# Altium project LoggerBoard.PrjPcb (part 1 of 2)
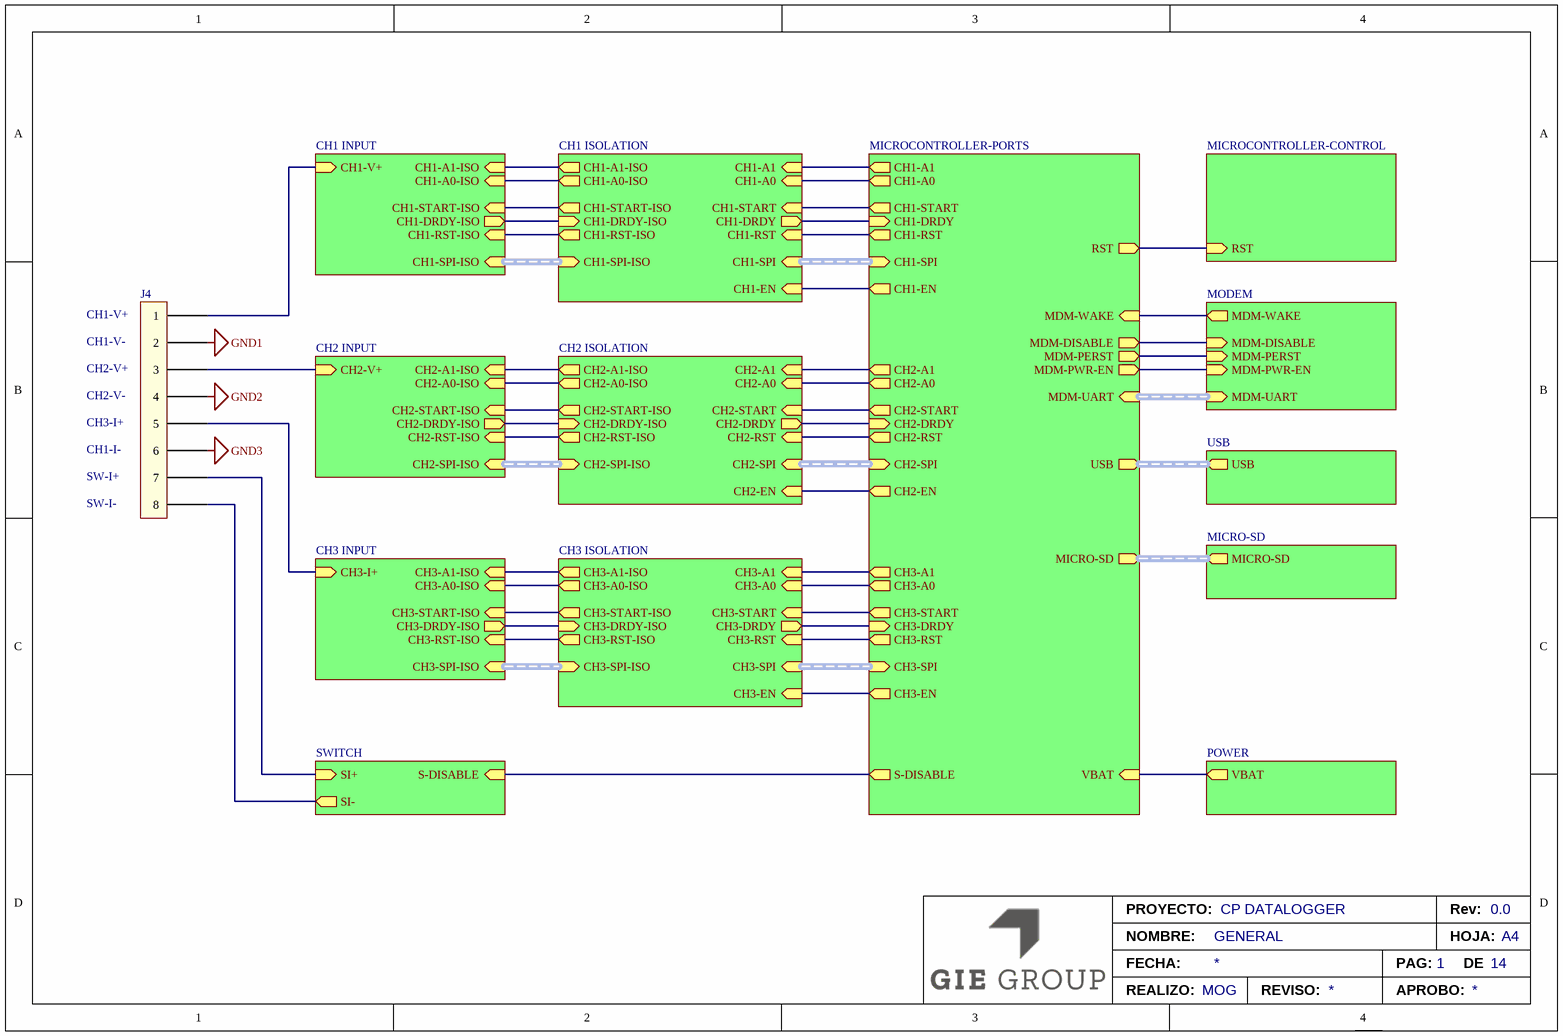
[diagram p0: General.SchDoc]
14 sheets, 197 parts. Net scope: hierarchical (ports join the sheet entries above them; power ports are global).
Board file: LoggerBoard.PcbDoc
Sheets:
  General.SchDoc
    CH1 INPUT = CH1-Input.SchDoc
    CH1 ISOLATION = CH1-Isolation.SchDoc
    CH2 INPUT = CH2-Input.SchDoc
    CH2 ISOLATION = CH2-Isolation.SchDoc
    MODEM = Modem.SchDoc
    CH3 INPUT = CH3-Input.SchDoc
    CH3 ISOLATION = CH3-Isolation.SchDoc
    SWITCH = Switch.SchDoc
    MICROCONTROLLER-PORTS = MicrocontrollerPorts.SchDoc
    POWER = Power.SchDoc
    MICROCONTROLLER-CONTROL = MicrocontrollerControl.SchDoc
    USB = Usb.SchDoc
    MICRO-SD = MicroSD.SchDoc

## Sheet General.SchDoc: GENERAL
size A4; Author: MOG; CompanyName: GIE GROUP; DrawnBy: MOG; Organization: Gie SA; Address1: Galicia 52; Address2: Mar del Plata; Address3: Buenos Aires; Address4: Argentina; DocumentNumber: 1; Revision: 0.0; SheetNumber: 1; SheetTotal: 14; Project: CP DATALOGGER; PageSetup: Record=PageOptions|CenterHorizontal=True|CenterVertical=True|PrintScale=0.94|XCorrection=1.00|YCorrection=1.00|PrintKind=0|BorderSize=5000000|LeftOffset=0|BottomOffset=0|Orientation=2|PaperLength=1000|PaperWidth=1000|Scale=100|PaperSource=7|PrintQuality=720|MediaType=1|DitherType=10|PaperKind=A4|PrintScaleMode=1

### Parts
J4  (no value)  [TE-640455-8]

### Sub-sheets
CH1 INPUT = CH1-Input.SchDoc: CH1-A0-ISO (in), CH1-A1-ISO (in), CH1-START-ISO (in), CH1-DRDY-ISO (out), CH1-RST-ISO (in), CH1-SPI-ISO (in, harness CH1-SPI-ISO), CH1-V+ (in)
CH1 ISOLATION = CH1-Isolation.SchDoc: CH1-A0-ISO (out), CH1-A1-ISO (out), CH1-START-ISO (out), CH1-DRDY-ISO (in), CH1-RST-ISO (out), CH1-SPI-ISO (in, harness CH1-SPI-ISO), CH1-A0 (in), CH1-A1 (in), CH1-START (in), CH1-DRDY (out), CH1-RST (in), CH1-SPI (in, harness CH1-SPI), CH1-EN (in)
CH2 INPUT = CH2-Input.SchDoc: CH2-A0-ISO (in), CH2-A1-ISO (in), CH2-START-ISO (in), CH2-DRDY-ISO (out), CH2-RST-ISO (in), CH2-SPI-ISO (in, harness CH2-SPI-ISO), CH2-V+ (in)
CH2 ISOLATION = CH2-Isolation.SchDoc: CH2-A0-ISO (out), CH2-A1-ISO (out), CH2-START-ISO (out), CH2-DRDY-ISO (in), CH2-RST-ISO (out), CH2-SPI-ISO (in, harness CH2-SPI-ISO), CH2-A0 (in), CH2-A1 (in), CH2-START (in), CH2-DRDY (out), CH2-RST (in), CH2-SPI (in, harness CH2-SPI), CH2-EN (in)
CH3 INPUT = CH3-Input.SchDoc: CH3-A0-ISO (in), CH3-A1-ISO (in), CH3-START-ISO (in), CH3-DRDY-ISO (out), CH3-RST-ISO (in), CH3-SPI-ISO (in, harness CH3-SPI-ISO), CH3-I+ (in)
CH3 ISOLATION = CH3-Isolation.SchDoc: CH3-A0-ISO (out), CH3-A1-ISO (out), CH3-START-ISO (out), CH3-DRDY-ISO (in), CH3-RST-ISO (out), CH3-SPI-ISO (in, harness CH3-SPI-ISO), CH3-A0 (in), CH3-A1 (in), CH3-START (in), CH3-DRDY (out), CH3-RST (in), CH3-SPI (in, harness CH3-SPI), CH3-EN (in)
MICRO-SD = MicroSD.SchDoc: MICRO-SD (out, harness MICRO-SD)
MICROCONTROLLER-CONTROL = MicrocontrollerControl.SchDoc: RST (in)
MICROCONTROLLER-PORTS = MicrocontrollerPorts.SchDoc: CH1-A0 (out), CH1-A1 (out), CH1-START (out), CH1-DRDY (in), CH1-RST (out), CH1-SPI (in, harness CH1-SPI), CH1-EN (out), CH2-A0 (out), CH2-A1 (out), CH2-START (out), CH2-DRDY (in), CH2-RST (out), CH2-SPI (in, harness CH2-SPI), CH2-EN (out), CH3-A0 (out), CH3-A1 (out), CH3-START (out), CH3-DRDY (in), CH3-RST (out), CH3-SPI (in, harness CH3-SPI), CH3-EN (out), S-DISABLE (out), MDM-UART (in, harness MDM-UART), MDM-WAKE (in), MDM-DISABLE (out), MDM-PERST (out), MDM-PWR-EN (out), VBAT (in), RST (out), USB (out, harness USB), MICRO-SD (out, harness MICRO-SD)
MODEM = Modem.SchDoc: MDM-UART (in, harness MDM-UART), MDM-WAKE (out), MDM-DISABLE (in), MDM-PERST (in), MDM-PWR-EN (in)
POWER = Power.SchDoc: VBAT (out)
SWITCH = Switch.SchDoc: S-DISABLE (in), SI+ (in), SI- (out)
USB = Usb.SchDoc: USB (out, harness USB)

### Nets
GND1: J4.2
GND2: J4.4
GND3: J4.6
CH1-A0: sheet CH1 ISOLATION/CH1-A0, sheet MICROCONTROLLER-PORTS/CH1-A0
CH1-A1: sheet CH1 ISOLATION/CH1-A1, sheet MICROCONTROLLER-PORTS/CH1-A1
CH1-DRDY: sheet CH1 ISOLATION/CH1-DRDY, sheet MICROCONTROLLER-PORTS/CH1-DRDY
CH1-EN: sheet CH1 ISOLATION/CH1-EN, sheet MICROCONTROLLER-PORTS/CH1-EN
CH1-RST: sheet CH1 ISOLATION/CH1-RST, sheet MICROCONTROLLER-PORTS/CH1-RST
CH1-START: sheet CH1 ISOLATION/CH1-START, sheet MICROCONTROLLER-PORTS/CH1-START
CH2-A0: sheet CH2 ISOLATION/CH2-A0, sheet MICROCONTROLLER-PORTS/CH2-A0
CH2-A1: sheet CH2 ISOLATION/CH2-A1, sheet MICROCONTROLLER-PORTS/CH2-A1
CH2-DRDY: sheet CH2 ISOLATION/CH2-DRDY, sheet MICROCONTROLLER-PORTS/CH2-DRDY
CH2-EN: sheet CH2 ISOLATION/CH2-EN, sheet MICROCONTROLLER-PORTS/CH2-EN
CH2-RST: sheet CH2 ISOLATION/CH2-RST, sheet MICROCONTROLLER-PORTS/CH2-RST
CH2-START: sheet CH2 ISOLATION/CH2-START, sheet MICROCONTROLLER-PORTS/CH2-START
CH3-A0: sheet CH3 ISOLATION/CH3-A0, sheet MICROCONTROLLER-PORTS/CH3-A0
CH3-A1: sheet CH3 ISOLATION/CH3-A1, sheet MICROCONTROLLER-PORTS/CH3-A1
CH3-DRDY: sheet CH3 ISOLATION/CH3-DRDY, sheet MICROCONTROLLER-PORTS/CH3-DRDY
CH3-EN: sheet CH3 ISOLATION/CH3-EN, sheet MICROCONTROLLER-PORTS/CH3-EN
CH3-RST: sheet CH3 ISOLATION/CH3-RST, sheet MICROCONTROLLER-PORTS/CH3-RST
CH3-START: sheet CH3 ISOLATION/CH3-START, sheet MICROCONTROLLER-PORTS/CH3-START
MDM-DISABLE: sheet MODEM/MDM-DISABLE, sheet MICROCONTROLLER-PORTS/MDM-DISABLE
MDM-PERST: sheet MODEM/MDM-PERST, sheet MICROCONTROLLER-PORTS/MDM-PERST
MDM-PWR-EN: sheet MODEM/MDM-PWR-EN, sheet MICROCONTROLLER-PORTS/MDM-PWR-EN
MDM-WAKE: sheet MODEM/MDM-WAKE, sheet MICROCONTROLLER-PORTS/MDM-WAKE
RST: sheet MICROCONTROLLER-PORTS/RST, sheet MICROCONTROLLER-CONTROL/RST
S-DISABLE: sheet SWITCH/S-DISABLE, sheet MICROCONTROLLER-PORTS/S-DISABLE
NetGDT1_1: J4.1 ; sheet CH1 INPUT/CH1-V+
NetGDT2_1: J4.3 ; sheet CH2 INPUT/CH2-V+
NetGDT3_1: J4.5 ; sheet CH3 INPUT/CH3-I+
NetJ4_7: J4.7 ; sheet SWITCH/SI+
NetJ4_8: J4.8 ; sheet SWITCH/SI-
NetJ10_2: sheet MICROCONTROLLER-PORTS/VBAT, sheet POWER/VBAT
NetU2_4: sheet CH1 INPUT/CH1-A0-ISO, sheet CH1 ISOLATION/CH1-A0-ISO
NetU2_5: sheet CH1 INPUT/CH1-A1-ISO, sheet CH1 ISOLATION/CH1-A1-ISO
NetU4_3: sheet CH1 INPUT/CH1-RST-ISO, sheet CH1 ISOLATION/CH1-RST-ISO
NetU4_4: sheet CH1 INPUT/CH1-START-ISO, sheet CH1 ISOLATION/CH1-START-ISO
NetU4_10: sheet CH1 INPUT/CH1-DRDY-ISO, sheet CH1 ISOLATION/CH1-DRDY-ISO
NetU10_4: sheet CH2 INPUT/CH2-A0-ISO, sheet CH2 ISOLATION/CH2-A0-ISO
NetU10_5: sheet CH2 INPUT/CH2-A1-ISO, sheet CH2 ISOLATION/CH2-A1-ISO
NetU12_3: sheet CH2 INPUT/CH2-RST-ISO, sheet CH2 ISOLATION/CH2-RST-ISO
NetU12_4: sheet CH2 INPUT/CH2-START-ISO, sheet CH2 ISOLATION/CH2-START-ISO
NetU12_10: sheet CH2 INPUT/CH2-DRDY-ISO, sheet CH2 ISOLATION/CH2-DRDY-ISO
NetU18_4: sheet CH3 INPUT/CH3-A0-ISO, sheet CH3 ISOLATION/CH3-A0-ISO
NetU18_5: sheet CH3 INPUT/CH3-A1-ISO, sheet CH3 ISOLATION/CH3-A1-ISO
NetU20_3: sheet CH3 INPUT/CH3-RST-ISO, sheet CH3 ISOLATION/CH3-RST-ISO
NetU20_4: sheet CH3 INPUT/CH3-START-ISO, sheet CH3 ISOLATION/CH3-START-ISO
NetU20_10: sheet CH3 INPUT/CH3-DRDY-ISO, sheet CH3 ISOLATION/CH3-DRDY-ISO

### Buses and harness runs
harness sheet CH1 INPUT/CH1-SPI-ISO = sheet CH1 ISOLATION/CH1-SPI-ISO
harness sheet CH1 ISOLATION/CH1-SPI = sheet MICROCONTROLLER-PORTS/CH1-SPI
harness sheet CH2 INPUT/CH2-SPI-ISO = sheet CH2 ISOLATION/CH2-SPI-ISO
harness sheet CH2 ISOLATION/CH2-SPI = sheet MICROCONTROLLER-PORTS/CH2-SPI
harness sheet CH3 INPUT/CH3-SPI-ISO = sheet CH3 ISOLATION/CH3-SPI-ISO
harness sheet CH3 ISOLATION/CH3-SPI = sheet MICROCONTROLLER-PORTS/CH3-SPI
harness sheet MICRO-SD/MICRO-SD = sheet MICROCONTROLLER-PORTS/MICRO-SD
harness sheet MICROCONTROLLER-PORTS/MDM-UART = sheet MODEM/MDM-UART
harness sheet MICROCONTROLLER-PORTS/USB = sheet USB/USB

### Notes on the sheet
- (near J4) CH1-V+
- (near J4) CH1-V-
- (near J4) CH2-V+
- (near J4) CH2-V-
- (near J4) CH3-I+
- (near J4) CH1-I-
- (near J4) SW-I+
- (near J4) SW-I-
- PROYECTO:
- Rev:
- NOMBRE:
- FECHA:
- REALIZO:
- REVISO:
- APROBO:
- PAG:
- HOJA:
- DE
- A4

### Library data of the parts
J4 = 640455-8: CONN HEADER RTANG 8POS .100 TIN; Mating Conn: 1375820-8

## Sheet CH1-Input.SchDoc: CH1 INPUT
size A4; Author: MOG; CompanyName: GIE GROUP; DrawnBy: MOG; Organization: Gie SA; Address1: Galicia 52; Address2: Mar del Plata; Address3: Buenos Aires; Address4: Argentina; DocumentNumber: 2; Revision: 0.0; SheetNumber: 2; SheetTotal: 14; Project: CP DATALOGGER; PageSetup: Record=PageOptions|CenterHorizontal=True|CenterVertical=True|PrintScale=0.94|XCorrection=1.00|YCorrection=1.00|PrintKind=0|BorderSize=5000000|LeftOffset=0|BottomOffset=0|Orientation=2|PaperLength=1000|PaperWidth=1000|Scale=100|PaperSource=7|PrintQuality=720|MediaType=1|DitherType=10|PaperKind=A4|PrintScaleMode=1
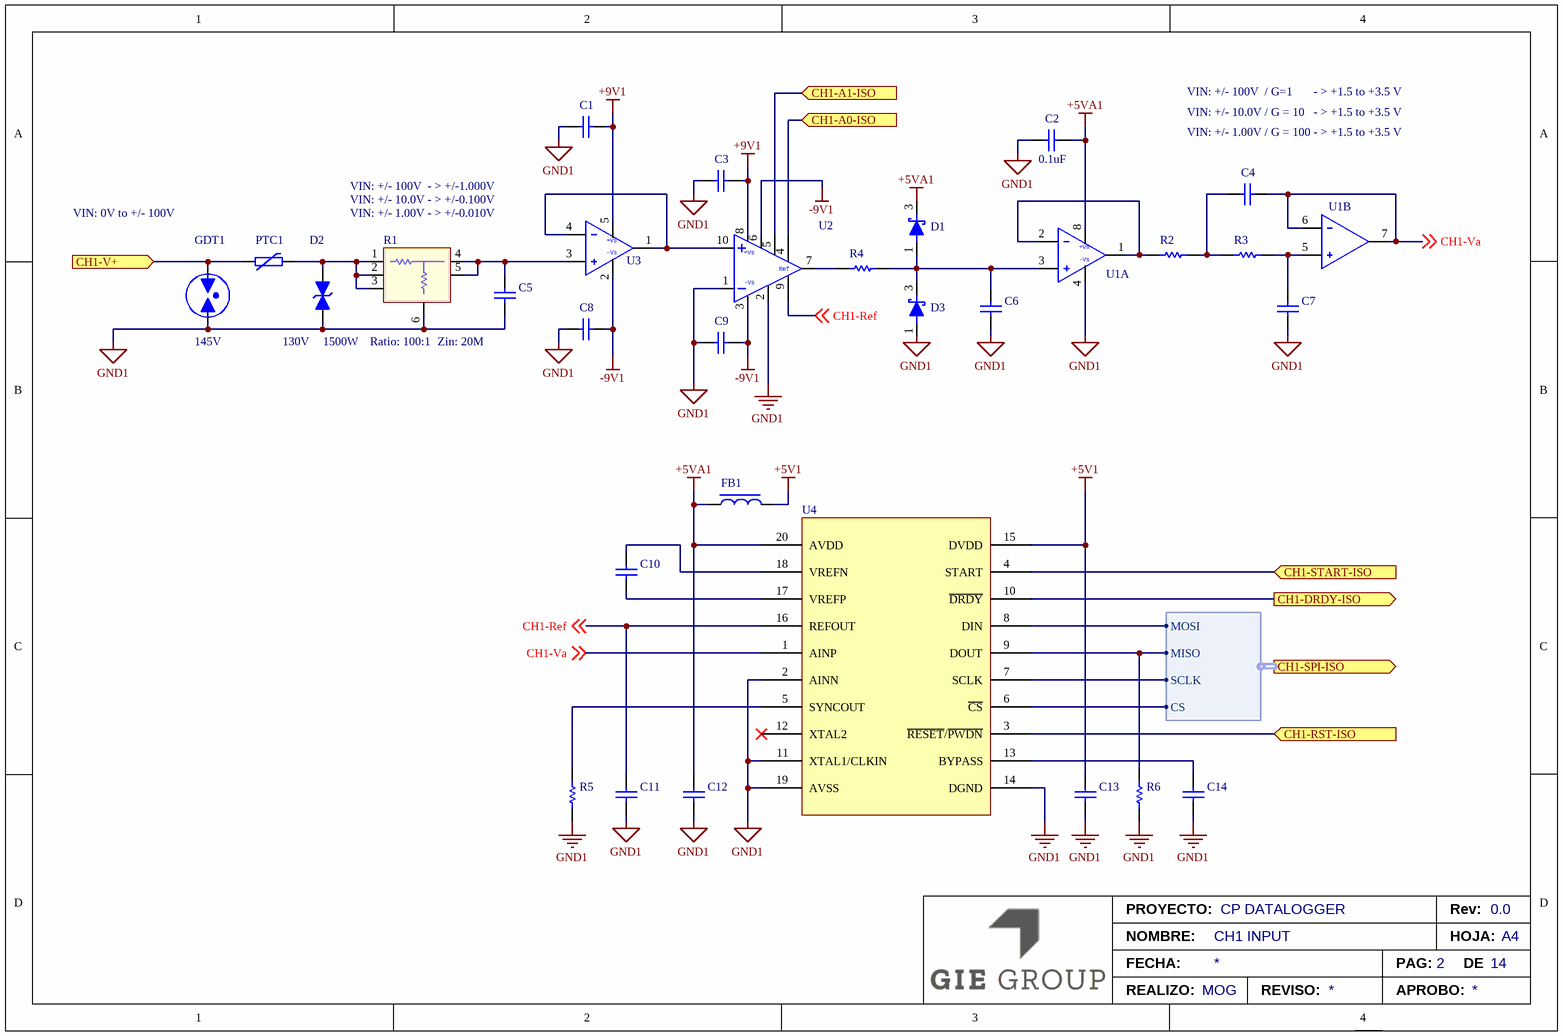
[diagram p1: CH1-Input.SchDoc]

### Parts
C1  C0603C104K5RACAUTO  [CAP-0603]  (value not drawn)
C2  value 0.1uF  [CAP-0603]  (hidden comment: C0603C104K5RACAUTO)
C3  C0603C104K5RACAUTO  [CAP-0603]  (value not drawn)
C4  C0603C162J5GAC7867  [CAP-0603]  (value not drawn)
C5  C0603C161J1GAC7867  [CAP-0603]  (value not drawn)
C6  C0603C162J5GAC7867  [CAP-0603]  (value not drawn)
C7  C0603C161J1GAC7867  [CAP-0603]  (value not drawn)
C8  C0603C104K5RACAUTO  [CAP-0603]  (value not drawn)
C9  C0603C104K5RACAUTO  [CAP-0603]  (value not drawn)
C10  C0603C105M3RAC7867  [CAP-0603]  (value not drawn)
C11  C0603C105M3RAC7867  [CAP-0603]  (value not drawn)
C12  C0603C105M3RAC7867  [CAP-0603]  (value not drawn)
C13  C0603C105M3RAC7867  [CAP-0603]  (value not drawn)
C14  C0603C105M3RAC7867  [CAP-0603]  (value not drawn)
D1  NSVBAT54WT1G  [SOT-323-3]  (value not drawn)
D2  Voltage: 130V  Power: 1500W  [SMC - BIIDIR]
D3  (no value)  [SOT-323-3]
FB1  Z0603C121GPWZT  [IND-0603]  (value not drawn)
GDT1  Voltage: 145V  [LITTLELFUSE-CG5XXXLTR]
PTC1  (no value)  [LITTLELFUSE-72R020X]
R1  Ratio: 100:1  Zin: 20M  [CADDOCK - HVD5-B20M-050-05]
R2  RC0603FR-07113KL  [RES-0603]  (value not drawn)
R3  RC0603FR-07887KL  [RES-0603]  (value not drawn)
R4  RC0603FR-07100KL  [RES-0603]  (value not drawn)
R5  RC0603FR-071ML  [RES-0603]  (value not drawn)
R6  RC0603FR-071ML  [RES-0603]  (value not drawn)
U1  (no value)  [MSOP8]  (parts A,B of 2)
U2  AD8253ARMZ  [MSOP10]  (value not drawn)
U3  (no value)  [SOT23-5]
U4  (no value)  [TSSOP20]

### Ports
CH1-A0-ISO (in), CH1-A1-ISO (in), CH1-DRDY-ISO (out), CH1-RST-ISO (in), CH1-SPI-ISO (out, harness CH1-SPI-ISO), CH1-START-ISO (in), CH1-V+ (in)

### Harnesses
CH1-SPI-ISO: MOSI, MISO, SCLK, CS

### Nets
+5V1: C13.2 FB1.2 U4.15(DVDD)
+5VA1: C2.2 C12.2 D1.3(K) FB1.1 U1.8(+VS) U4.20(AVDD)
+9V1: C1.2 C3.2 U2.8(+Vs) U3.5(+VS)
-9V1: C8.2 C9.2 U2.3(-Vs) U2.6(WR) U3.2(-Vs)
GND1: C1.1 C2.1 C3.1 C5.1 C6.1 C7.1 C8.1 C9.1 C11.1 C12.1 C13.1 C14.1 D2.2(K) D3.1(A) GDT1.2(K) R1.6 R5.1 R6.1 U1.4(-Vs) U2.1(-_IN) U2.2(DGND) U4.2(AINN) U4.11(XTAL1/CLKIN) U4.14(DGND) U4.19(AVSS)
CH1-Ref: C11.2 U2.9(REF) U4.16(REFOUT) ; off-sheet CH1-Ref
CH1-Va: C4.1 U1.6(-INB) U1.7(OUTB) U4.1(AINP) ; off-sheet CH1-Va
NetC4_2: C4.2 R2.2 R3.1
NetC5_2: C5.2 R1.4 R1.5 U3.3(+IN)
NetC6_2: C6.2 D1.1(A) D3.3(K) R4.2 U1.3(+INA)
NetC7_2: C7.2 R3.2 U1.5(+INB)
NetC10_1: C10.1 U4.17(VREFP)
NetC10_2: C10.2 U4.18(VREFN)
NetC14_2: C14.2 U4.13(BYPASS)
NetD2_1: D2.1(A) PTC1.2 R1.1 R1.2 R1.3
NetGDT1_1: GDT1.1(A) PTC1.1 ; port CH1-V+
NetR2_1: R2.1 U1.1(OUTA) U1.2(-INA)
NetR4_1: R4.1 U2.7(OUT)
NetR5_2: R5.2 U4.5(SYNCOUT)
NetR6_2: R6.2 U4.9(DOUT) ; port CH1-SPI-ISO.MISO
NetU2_4: U2.4(A0) ; port CH1-A0-ISO
NetU2_5: U2.5(A1) ; port CH1-A1-ISO
NetU2_10: U2.10(+_IN) U3.1(OUT) U3.4(-IN)
NetU4_3: U4.3(~{RESET}/~{PWDN}) ; port CH1-RST-ISO
NetU4_4: U4.4(START) ; port CH1-START-ISO
NetU4_6: U4.6(~{CS}) ; port CH1-SPI-ISO.CS
NetU4_7: U4.7(SCLK) ; port CH1-SPI-ISO.SCLK
NetU4_8: U4.8(DIN) ; port CH1-SPI-ISO.MOSI
NetU4_10: U4.10(~{DRDY}) ; port CH1-DRDY-ISO

Not connected (* = marked no-connect by the designer): U4 12(XTAL2)*

### Notes on the sheet
- VIN: +/- 100V  / G=1       - > +1.5 to +3.5 V
- VIN: +/- 10.0V / G = 10   - > +1.5 to +3.5 V
- VIN: +/- 1.00V / G = 100 - > +1.5 to +3.5 V
- VIN: 0V to +/- 100V
- VIN: +/- 100V  - > +/-1.000V
- VIN: +/- 10.0V - > +/-0.100V
- (near R1) VIN: +/- 1.00V - > +/-0.010V
- PROYECTO:
- Rev:
- NOMBRE:
- FECHA:
- REALIZO:
- REVISO:
- APROBO:
- PAG:
- HOJA:
- DE
- A4
- (in symbol AD8253ARMZ) Ref
- (in symbol AD8638ARJZ) +Vs
- (in symbol ADA4051-2ARMZ, part A) +Vs

### Library data of the parts
C1-C3 C8 C9 = C0603C104K5RACAUTO: CAP CER 0.1uF 50V X7R 0603; Manufacturer: Kemet; Tolerance: 10%; Voltage: 50; PartNumber: C0603C104K5RACAUTO; Supplier 1: Digi-Key; Supplier 2: Mouser; Supplier Part Number 1: 399-6856-1-ND; Supplier Part Number 2: 80-C0603C104K5RAUTO
C4 C6 = C0603C162J5GAC7867: CAP CER 1600´pF 50V C0G 0603; Manufacturer: Kemet; Tolerance: 5%; Voltage: 50; PartNumber: C0603C162J5GAC7867; Supplier 1: Digi-Key; Supplier 2: Mouser; Supplier Part Number 1: 399-15368-1-ND; Supplier Part Number 2: 80-C0603C162J5G
C5 = C0603C751J5GAC7867: CAP CER 750´pF 50V C0G 0603; Manufacturer: Kemet; Tolerance: 5%; PartNumber: C0603C161J1GAC7867; Voltage: 50V; Supplier 1: Digi-Key; Supplier 2: Mouser; Supplier Part Number 1: 399-C0603C751J5GAC7867CT-ND; Supplier Part Number 2: 80-C0603C751J5G
C7 = C0603C161J1GAC7867: CAP CER 160 pF 100V C0G 0603; Manufacturer: Kemet; Tolerance: 5%; PartNumber: C0603C161J1GAC7867; Voltage: 100V; Supplier 1: Digi-Key; Supplier Part Number 1: 399-15367-1-ND
C10-C14 = C0603C105M3RAC7867: CAP CER 1uF 25V X7R 0603; Manufacturer: Kemet; Tolerance: 20%; Voltage: 25; PartNumber: C0603C105M3RAC7867; Supplier 1: Digi-Key; Supplier 2: Mouser; Supplier Part Number 1: 399-C0603C105M3RAC7867CT-ND; Supplier Part Number 2: 80-C0603C105M3R
D1 D3 = NSVBAT54WT1G: Schottky Diode 30V 200mA SOT323; Manufacturer: OnSemiconductor; IF(avg): 0.2A; VR(rms): 30V; Supplier 1: Digi-Key; Supplier 2: Mouser; Supplier Part Number 1: NSVBAT54WT1GOSDKR-ND; Supplier Part Number 2: 863-NSVBAT54WT1G
  D1: PartNumber: NSVBAT54WT1G
D2 = 1.5SMC130CA: TVS Diode 1.5kW 130V 5% Bi-Directional; Manufacturer: Littelfuse; Supplier 1: Digi-Key; Supplier 2: Mouser; Supplier Part Number 1: 1.5SMC130CACT-ND; Supplier Part Number 2: 576-1.5SMC130CA
FB1 = Z0603C121GPWZT: Ferrite Bead 120Ohms 900mA 25% DCR=130m; Manufacturer: Kemet; PartNumber: Z0603C121GPWZT; Supplier 1: Digi-Key; Supplier 2: Mouser; Supplier Part Number 1: 399-Z0603C121GPWZTCT-ND; Supplier Part Number 2: 80-Z0603C121GPWZT
GDT1 = CG5145LTR: Gas Discharge Tube 145V; Manufacturer: Littelfuse; Supplier 1: Digi-Key; Supplier 2: Mouser; Supplier Part Number 1: CG5145LTR-ND; Supplier Part Number 2: 576-CG5145LTR
PTC1 = 72R020XPR: PTC Polyfuse Radial 72V 0.2A; Manufacturer: Littlelfuse; Ihold: 0.2A; Supplier 1: Digi-Key; Supplier 2: Mouser; Supplier Part Number 1: 72R020XPRCT-ND; Supplier Part Number 2: 576-72R020XPR
R1 = HVD5-B20M-050-05: 20M ohm 0.05% 5ppm Voltage Divider; Manufacturer: Caddock; Supplier 1: Digi-Key; Supplier 2: Mouser; Supplier Part Number 1: HVD5-B20M-050-05-ND; Supplier Part Number 2: 684-HVD5-B20M
R2 = RC0603FR-07113KL: RES SMD 113K OHM 1% 1/10W 0603; Manufacturer: Yageo; Power: 0.1W; Tolerance: 1%; PartNumber: RC0603FR-07113KL; Supplier 1: Digi-Key; Supplier 2: Mouser; Supplier Part Number 2: 603-RC0603FR-07113KL; Supplier Part Number 1: 311-113KHRCT-ND
R3 = RC0603FR-07887KL: RES SMD 887K OHM 1% 1/10W 0603; Manufacturer: Yageo; Power: 0.1W; Tolerance: 1%; PartNumber: RC0603FR-07887KL; Supplier 1: Digi-Key; Supplier 2: Mouser; Supplier Part Number 1: 311-887KHRCT-ND; Supplier Part Number 2: 603-RC0603FR-07887KL
R4 = RC0603FR-07100KL: RES SMD 100K OHM 1% 1/10W 0603; Manufacturer: Yageo; Power: 0.1W; Tolerance: 1%; PartNumber: RC0603FR-07100KL; Supplier 1: Digi-Key; Supplier 2: Mouser; Supplier Part Number 1: 311-100KHRCT-ND; Supplier Part Number 2: 603-RC0603FR-07100KL
R5 R6 = RC0603FR-071ML: RES SMD 1M OHM 1% 1/10W 0603; Manufacturer: Yageo; Power: 0.1W; Tolerance: 1%; PartNumber: RC0603FR-071ML; Supplier 1: Digi-Key; Supplier 2: Mouser; Supplier Part Number 1: 311-887KHRCT-ND; Supplier Part Number 2: 603-RC0603FR-07887KL
U1 = ADA4051-2ARMZ: Dual  Precision Amplifier Micro Power Auto Zero; Manufacturer: Analog Devices; Supplier 1: Digi-Key; Supplier 2: Mouser; Supplier Part Number 1: 505-ADA4051-2ARMZ-ND; Supplier Part Number 2: 584-ADA4051-2ARMZ
U2 = AD8253ARMZ: Instrumentation Amplifiers High Speed Programmable High Gain In-Amp; Manufacturer: Analog Devices Inc; PartNumber: AD8253ARMZ; Supplier 1: Digi-Key; Supplier 2: Mouser; Supplier Part Number 1: 505-AD8253ARMZ-R7DKR-ND; Supplier Part Number 2: 584-AD8253ARMZ-R7
U3 = AD8638ARJZ: 16V Auto-Zero CMOS Amplifier; Manufacturer: Analog Devices; Supplier 1: Digi-Key; Supplier 2: Mouser; Supplier Part Number 1: 505-AD8638ARJZ-REEL7DKR-ND; Supplier Part Number 2: 584-AD8638ARJZ-R7
U4 = ADS1259BIPW: Analog to Digital Converter 14.4kSPS 24-Bit; Manufacturer: Texas Instruments; Supplier 1: Digi-Key; Supplier 2: Mouser; Supplier Part Number 1: 296-27183-5-ND; Supplier Part Number 2: 595-ADS1259BIPW

## Sheet CH1-Isolation.SchDoc: CH1 ISOLATION
size A4; Author: MOG; CompanyName: GIE GROUP; DrawnBy: MOG; Organization: Gie SA; Address1: Galicia 52; Address2: Mar del Plata; Address3: Buenos Aires; Address4: Argentina; DocumentNumber: 3; Revision: 0.0; SheetNumber: 3; SheetTotal: 14; Project: CP DATALOGGER; PageSetup: Record=PageOptions|CenterHorizontal=True|CenterVertical=True|PrintScale=0.94|XCorrection=1.00|YCorrection=1.00|PrintKind=0|BorderSize=5000000|LeftOffset=0|BottomOffset=0|Orientation=2|PaperLength=1000|PaperWidth=1000|Scale=100|PaperSource=7|PrintQuality=720|MediaType=1|DitherType=10|PaperKind=A4|PrintScaleMode=1
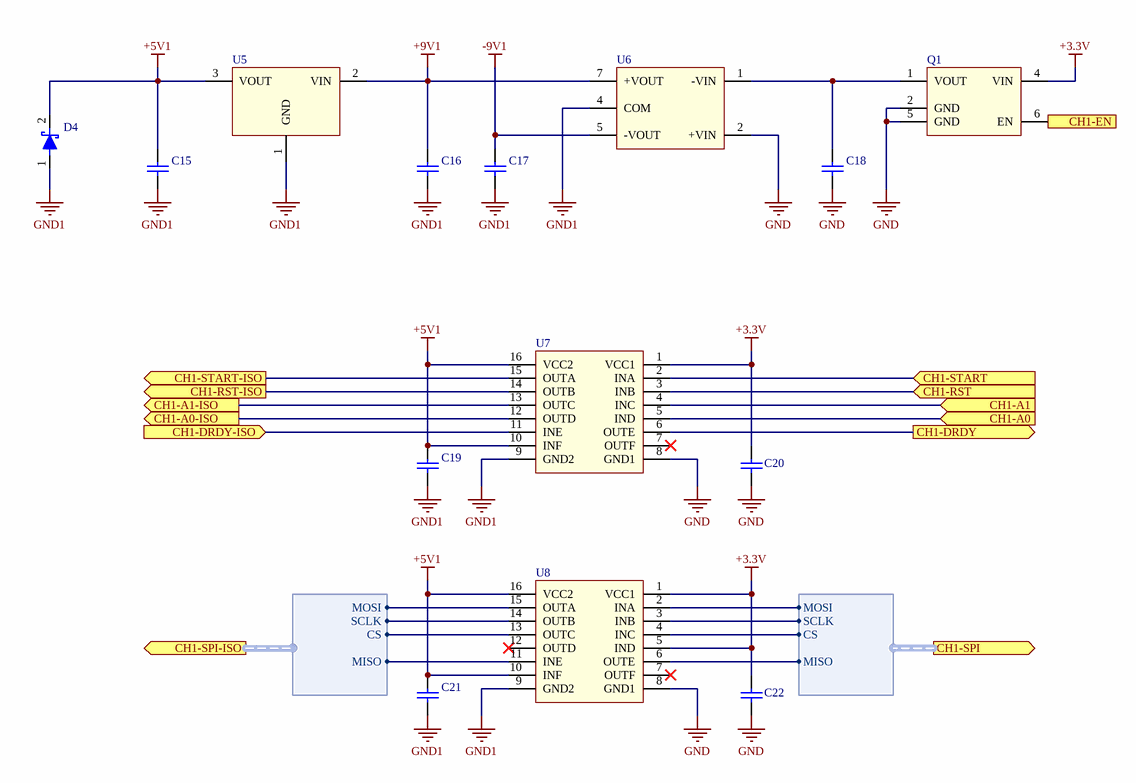
[diagram p2: CH1-Isolation.SchDoc]

### Parts
C15  C0603C105M3RAC7867  [CAP-0603]  (value not drawn)
C16  C0603C105M3RAC7867  [CAP-0603]  (value not drawn)
C17  C0603C105M3RAC7867  [CAP-0603]  (value not drawn)
C18  C0603C105M3RAC7867  [CAP-0603]  (value not drawn)
C19  C0603C105M3RAC7867  [CAP-0603]  (value not drawn)
C20  C0603C105M3RAC7867  [CAP-0603]  (value not drawn)
C21  C0603C105M3RAC7867  [CAP-0603]  (value not drawn)
C22  C0603C105M3RAC7867  [CAP-0603]  (value not drawn)
D4  (no value)  [SOD323 - DIODE UNIDIR]
Q1  (no value)  [TSSOP6]
U5  (no value)  [SOT23-5]
U6  R1D-3.309/P  [RECOM-R1D]  (value not drawn)
U7  (no value)  [SSOP16]
U8  (no value)  [SSOP16]

### Ports
CH1-A0 (in), CH1-A0-ISO (out), CH1-A1 (in), CH1-A1-ISO (out), CH1-DRDY (out), CH1-DRDY-ISO (in), CH1-EN (in), CH1-RST (in), CH1-RST-ISO (out), CH1-SPI (out, harness CH1-SPI), CH1-SPI-ISO (out, harness CH1-SPI-ISO), CH1-START (in), CH1-START-ISO (out)

### Harnesses
CH1-SPI-ISO: MOSI, MISO, SCLK, CS
CH1-SPI: MOSI, MISO, SCLK, CS

### Nets
+3.3V: C20.2 C22.2 Q1.4(VIN) U7.1(VCC1) U8.1(VCC1) U8.5(IND)
+5V1: C15.2 C19.2 C21.2 D4.2(K) U5.3(VOUT) U7.10(INF) U7.16(VCC2) U8.10(INF) U8.16(VCC2)
+9V1: C16.2 U5.2(VIN) U6.7(+VOUT)
-9V1: C17.2 U6.5(-VOUT)
GND: C18.1 C20.1 C22.1 Q1.2(GND) Q1.5(GND) U6.2(+VIN) U7.8(GND1) U8.8(GND1)
GND1: C15.1 C16.1 C17.1 C19.1 C21.1 D4.1(A) U5.1(GND) U6.4(COM) U7.9(GND2) U8.9(GND2)
CH1-A0: U7.5(IND) ; port CH1-A0
CH1-A1: U7.4(INC) ; port CH1-A1
CH1-DRDY: U7.6(OUTE) ; port CH1-DRDY
CH1-EN: Q1.6(EN) ; port CH1-EN
CH1-RST: U7.3(INB) ; port CH1-RST
CH1-SPI.CS: U8.4(INC) ; port CH1-SPI.CS
CH1-SPI.MISO: U8.6(OUTE) ; port CH1-SPI.MISO
CH1-SPI.MOSI: U8.2(INA) ; port CH1-SPI.MOSI
CH1-SPI.SCLK: U8.3(INB) ; port CH1-SPI.SCLK
CH1-START: U7.2(INA) ; port CH1-START
NetC18_2: C18.2 Q1.1(VOUT) U6.1(-VIN)
NetR6_2: U8.11(INE) ; port CH1-SPI-ISO.MISO
NetU2_4: U7.12(OUTD) ; port CH1-A0-ISO
NetU2_5: U7.13(OUTC) ; port CH1-A1-ISO
NetU4_3: U7.14(OUTB) ; port CH1-RST-ISO
NetU4_4: U7.15(OUTA) ; port CH1-START-ISO
NetU4_6: U8.13(OUTC) ; port CH1-SPI-ISO.CS
NetU4_7: U8.14(OUTB) ; port CH1-SPI-ISO.SCLK
NetU4_8: U8.15(OUTA) ; port CH1-SPI-ISO.MOSI
NetU4_10: U7.11(INE) ; port CH1-DRDY-ISO

Not connected (* = marked no-connect by the designer): U7 7(OUTF)*; U8 7(OUTF)* 12(OUTD)*

### Notes on the sheet
- PROYECTO:
- Rev:
- NOMBRE:
- FECHA:
- REALIZO:
- REVISO:
- APROBO:
- PAG:
- HOJA:
- DE
- A4

### Library data of the parts
C15-C22 = C0603C105M3RAC7867: as C10 on sheet CH1-Input; PartNumber: C0603C105M3RAC7867; Supplier 1: Digi-Key; Supplier 2: Mouser; Supplier Part Number 1: 399-C0603C105M3RAC7867CT-ND; Supplier Part Number 2: 80-C0603C105M3R
D4 = MM3Z5V6T1G: Schottky Diode 30V 200mA SOT323; Manufacturer: OnSemiconductor
Q1 = MIC94092YC6-TR: Manufacturer: Microchip
U5 = NCP716BCSN500T1G: IC REG LDO 0.5V 0.15A TSOT23-5; Manufacturer: ON Semiconductor
U6 = R1D-3.309/P: DC DC CONVERTER +/-9V 1W; Manufacturer: Recom; Supplier 1: Digi-Key; Supplier 2: Mouser; Supplier Part Number 1: R1D-3.309/P-ND; Supplier Part Number 2: 919-R1D-3.309P
U7 U8 = ISO7762FDBQ: Digital Isolator, six-channel, 4/2, 16-SSOP; Manufacturer: Texas Instruments; Supplier 1: Digi-Key; Supplier 2: Mouser; Supplier Part Number 1: 296-49452-6-ND; Supplier Part Number 2: 595-ISO7762FDBQR

## Sheet CH2-Input.SchDoc: CH2 INPUT
size A4; Author: MOG; CompanyName: GIE GROUP; DrawnBy: MOG; Organization: Gie SA; Address1: Galicia 52; Address2: Mar del Plata; Address3: Buenos Aires; Address4: Argentina; DocumentNumber: 4; Revision: 0.0; SheetNumber: 5; SheetTotal: 14; Project: CP DATALOGGER; PageSetup: Record=PageOptions|CenterHorizontal=True|CenterVertical=True|PrintScale=0.94|XCorrection=1.00|YCorrection=1.00|PrintKind=0|BorderSize=5000000|LeftOffset=0|BottomOffset=0|Orientation=2|PaperLength=1000|PaperWidth=1000|Scale=100|PaperSource=7|PrintQuality=720|MediaType=1|DitherType=10|PaperKind=A4|PrintScaleMode=1
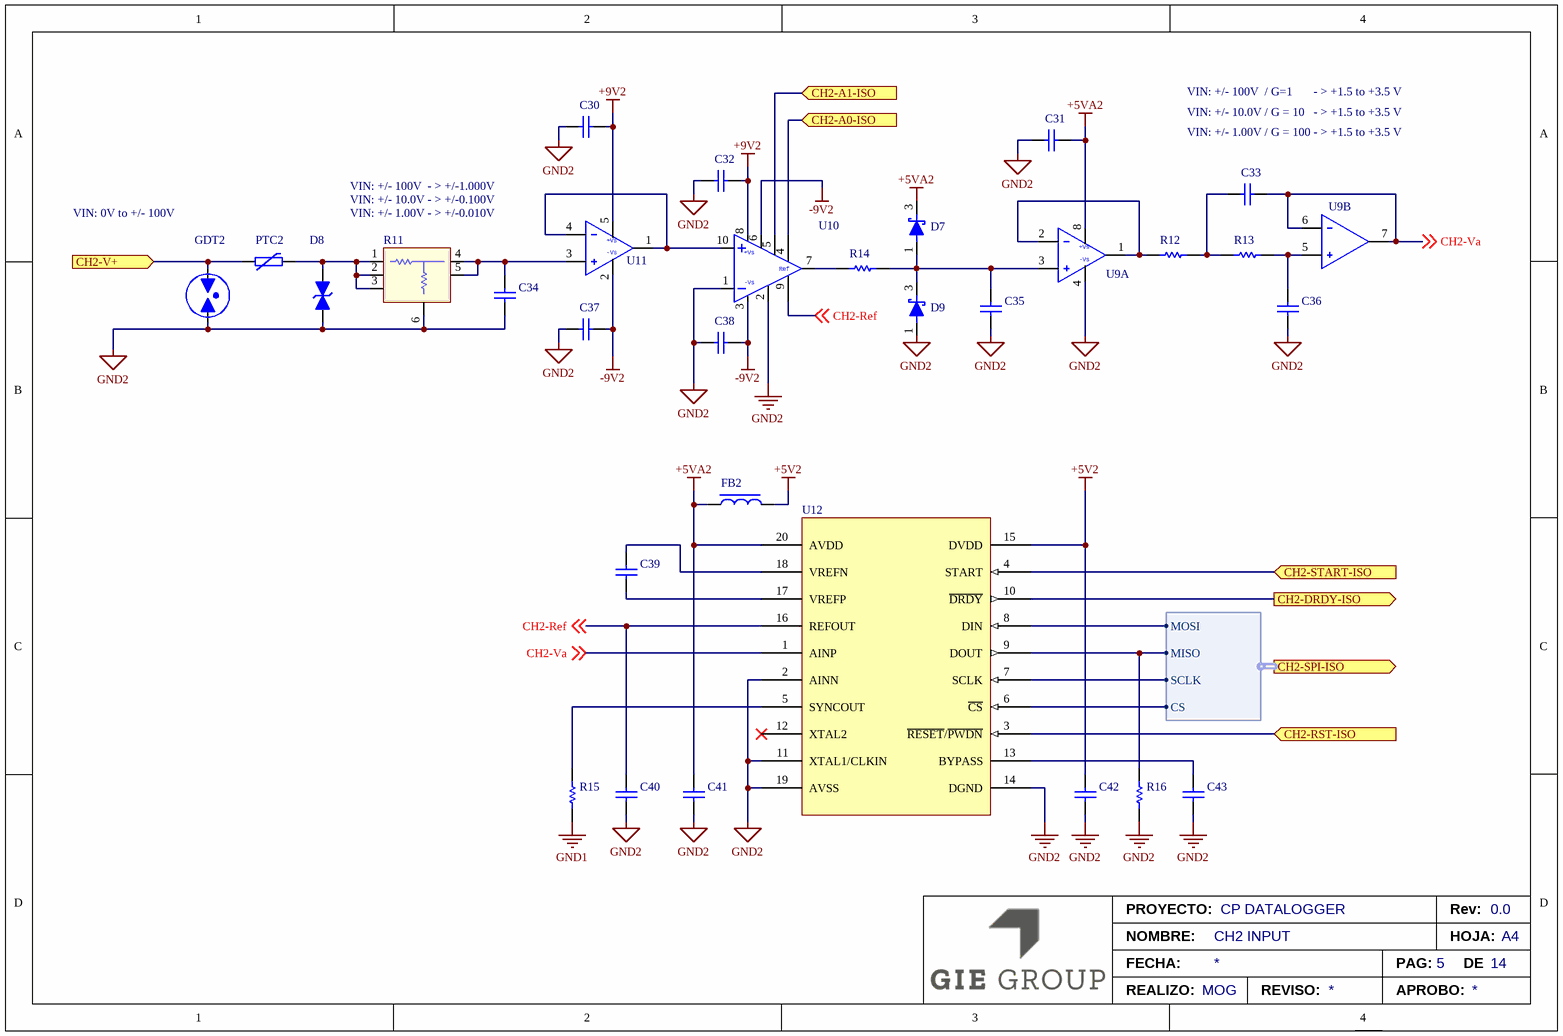
[diagram p3: CH2-Input.SchDoc]

### Parts
C30  C0603C104K5RACAUTO  [CAP-0603]  (value not drawn)
C31  C0603C104K5RACAUTO  [CAP-0603]  (value not drawn)
C32  C0603C104K5RACAUTO  [CAP-0603]  (value not drawn)
C33  C0603C162J5GAC7867  [CAP-0603]  (value not drawn)
C34  C0603C161J1GAC7867  [CAP-0603]  (value not drawn)
C35  C0603C162J5GAC7867  [CAP-0603]  (value not drawn)
C36  C0603C161J1GAC7867  [CAP-0603]  (value not drawn)
C37  C0603C104K5RACAUTO  [CAP-0603]  (value not drawn)
C38  C0603C104K5RACAUTO  [CAP-0603]  (value not drawn)
C39  C0603C105M3RAC7867  [CAP-0603]  (value not drawn)
C40  C0603C105M3RAC7867  [CAP-0603]  (value not drawn)
C41  C0603C105M3RAC7867  [CAP-0603]  (value not drawn)
C42  C0603C105M3RAC7867  [CAP-0603]  (value not drawn)
C43  C0603C105M3RAC7867  [CAP-0603]  (value not drawn)
D7  NSVBAT54WT1G  [SOT-323-3]  (value not drawn)
D8  (no value)  [SMC - BIIDIR]
D9  (no value)  [SOT-323-3]
FB2  Z0603C121GPWZT  [IND-0603]  (value not drawn)
GDT2  (no value)  [LITTLELFUSE-CG5XXXLTR]
PTC2  (no value)  [LITTLELFUSE-72R020X]
R11  (no value)  [CADDOCK - HVD5-B20M-050-05]
R12  RC0603FR-07113KL  [RES-0603]  (value not drawn)
R13  RC0603FR-07887KL  [RES-0603]  (value not drawn)
R14  RC0603FR-07100KL  [RES-0603]  (value not drawn)
R15  RC0603FR-071ML  [RES-0603]  (value not drawn)
R16  RC0603FR-071ML  [RES-0603]  (value not drawn)
U9  (no value)  [MSOP8]  (parts A,B of 2)
U10  AD8253ARMZ  [MSOP10]  (value not drawn)
U11  (no value)  [SOT23-5]
U12  (no value)  [TSSOP20]

### Ports
CH2-A0-ISO (in), CH2-A1-ISO (in), CH2-DRDY-ISO (out), CH2-RST-ISO (in), CH2-SPI-ISO (out, harness CH2-SPI-ISO), CH2-START-ISO (in), CH2-V+ (in)

### Harnesses
CH2-SPI-ISO: MOSI, MISO, SCLK, CS

### Nets
+5V2: C42.2 FB2.2 U12.15(DVDD)
+5VA2: C31.2 C41.2 D7.3(K) FB2.1 U9.8(+VS) U12.20(AVDD)
+9V2: C30.2 C32.2 U10.8(+Vs) U11.5(+VS)
-9V2: C37.2 C38.2 U10.3(-Vs) U10.6(WR) U11.2(-Vs)
GND1: R15.1
GND2: C30.1 C31.1 C32.1 C34.1 C35.1 C36.1 C37.1 C38.1 C40.1 C41.1 C42.1 C43.1 D8.2(K) D9.1(A) GDT2.2(K) R11.6 R16.1 U9.4(-Vs) U10.1(-_IN) U10.2(DGND) U12.2(AINN) U12.11(XTAL1/CLKIN) U12.14(DGND) U12.19(AVSS)
CH2-Ref: C40.2 U10.9(REF) U12.16(REFOUT) ; off-sheet CH2-Ref
CH2-Va: C33.1 U9.6(-INB) U9.7(OUTB) U12.1(AINP) ; off-sheet CH2-Va
NetC33_2: C33.2 R12.2 R13.1
NetC34_2: C34.2 R11.4 R11.5 U11.3(+IN)
NetC35_2: C35.2 D7.1(A) D9.3(K) R14.2 U9.3(+INA)
NetC36_2: C36.2 R13.2 U9.5(+INB)
NetC39_1: C39.1 U12.17(VREFP)
NetC39_2: C39.2 U12.18(VREFN)
NetC43_2: C43.2 U12.13(BYPASS)
NetD8_1: D8.1(A) PTC2.2 R11.1 R11.2 R11.3
NetGDT2_1: GDT2.1(A) PTC2.1 ; port CH2-V+
NetR12_1: R12.1 U9.1(OUTA) U9.2(-INA)
NetR14_1: R14.1 U10.7(OUT)
NetR15_2: R15.2 U12.5(SYNCOUT)
NetR16_2: R16.2 U12.9(DOUT) ; port CH2-SPI-ISO.MISO
NetU10_4: U10.4(A0) ; port CH2-A0-ISO
NetU10_5: U10.5(A1) ; port CH2-A1-ISO
NetU10_10: U10.10(+_IN) U11.1(OUT) U11.4(-IN)
NetU12_3: U12.3(~{RESET}/~{PWDN}) ; port CH2-RST-ISO
NetU12_4: U12.4(START) ; port CH2-START-ISO
NetU12_6: U12.6(~{CS}) ; port CH2-SPI-ISO.CS
NetU12_7: U12.7(SCLK) ; port CH2-SPI-ISO.SCLK
NetU12_8: U12.8(DIN) ; port CH2-SPI-ISO.MOSI
NetU12_10: U12.10(~{DRDY}) ; port CH2-DRDY-ISO

Not connected (* = marked no-connect by the designer): U12 12(XTAL2)*

### Notes on the sheet
- VIN: +/- 100V  / G=1       - > +1.5 to +3.5 V
- VIN: +/- 10.0V / G = 10   - > +1.5 to +3.5 V
- VIN: +/- 1.00V / G = 100 - > +1.5 to +3.5 V
- VIN: 0V to +/- 100V
- VIN: +/- 100V  - > +/-1.000V
- VIN: +/- 10.0V - > +/-0.100V
- (near R11) VIN: +/- 1.00V - > +/-0.010V
- PROYECTO:
- Rev:
- NOMBRE:
- FECHA:
- REALIZO:
- REVISO:
- APROBO:
- PAG:
- HOJA:
- DE
- A4
- (in symbol AD8253ARMZ) Ref
- (in symbol AD8638ARJZ) +Vs
- (in symbol ADA4051-2ARMZ, part A) +Vs

### Library data of the parts
C30-C32 C37 C38 = C0603C104K5RACAUTO: as C1 on sheet CH1-Input; PartNumber: C0603C104K5RACAUTO; Supplier 1: Digi-Key; Supplier 2: Mouser; Supplier Part Number 1: 399-6856-1-ND; Supplier Part Number 2: 80-C0603C104K5RAUTO
C33 C35 = C0603C162J5GAC7867: as C4 on sheet CH1-Input; PartNumber: C0603C162J5GAC7867; Supplier 1: Digi-Key; Supplier 2: Mouser; Supplier Part Number 1: 399-15368-1-ND; Supplier Part Number 2: 80-C0603C162J5G
C34 = C0603C751J5GAC7867: as C5 on sheet CH1-Input; PartNumber: C0603C161J1GAC7867; Voltage: 50V; Supplier 1: Digi-Key; Supplier 2: Mouser; Supplier Part Number 1: 399-C0603C751J5GAC7867CT-ND; Supplier Part Number 2: 80-C0603C751J5G
C36 = C0603C161J1GAC7867: as C7 on sheet CH1-Input; PartNumber: C0603C161J1GAC7867; Voltage: 100V; Supplier 1: Digi-Key; Supplier Part Number 1: 399-15367-1-ND
C39-C43 = C0603C105M3RAC7867: as C10 on sheet CH1-Input; PartNumber: C0603C105M3RAC7867; Supplier 1: Digi-Key; Supplier 2: Mouser; Supplier Part Number 1: 399-C0603C105M3RAC7867CT-ND; Supplier Part Number 2: 80-C0603C105M3R
D7 D9 = NSVBAT54WT1G: as D1 on sheet CH1-Input; VR(rms): 30V; Supplier 1: Digi-Key; Supplier 2: Mouser; Supplier Part Number 1: NSVBAT54WT1GOSDKR-ND; Supplier Part Number 2: 863-NSVBAT54WT1G
  D7: PartNumber: NSVBAT54WT1G
D8 = 1.5SMC130CA: as D2 on sheet CH1-Input; Supplier 1: Digi-Key; Supplier 2: Mouser; Supplier Part Number 1: 1.5SMC130CACT-ND; Supplier Part Number 2: 576-1.5SMC130CA
FB2 = Z0603C121GPWZT: as FB1 on sheet CH1-Input; PartNumber: Z0603C121GPWZT; Supplier 1: Digi-Key; Supplier 2: Mouser; Supplier Part Number 1: 399-Z0603C121GPWZTCT-ND; Supplier Part Number 2: 80-Z0603C121GPWZT
GDT2 = CG5145LTR: as GDT1 on sheet CH1-Input; Supplier 1: Digi-Key; Supplier 2: Mouser; Supplier Part Number 1: CG5145LTR-ND; Supplier Part Number 2: 576-CG5145LTR
PTC2 = 72R020XPR: as PTC1 on sheet CH1-Input; Ihold: 0.2A; Supplier 1: Digi-Key; Supplier 2: Mouser; Supplier Part Number 1: 72R020XPRCT-ND; Supplier Part Number 2: 576-72R020XPR
R11 = HVD5-B20M-050-05: as R1 on sheet CH1-Input; Supplier 1: Digi-Key; Supplier 2: Mouser; Supplier Part Number 1: HVD5-B20M-050-05-ND; Supplier Part Number 2: 684-HVD5-B20M
R12 = RC0603FR-07113KL: as R2 on sheet CH1-Input; Tolerance: 1%; PartNumber: RC0603FR-07113KL; Supplier 1: Digi-Key; Supplier 2: Mouser; Supplier Part Number 2: 603-RC0603FR-07113KL; Supplier Part Number 1: 311-113KHRCT-ND
R13 = RC0603FR-07887KL: as R3 on sheet CH1-Input; Tolerance: 1%; PartNumber: RC0603FR-07887KL; Supplier 1: Digi-Key; Supplier 2: Mouser; Supplier Part Number 1: 311-887KHRCT-ND; Supplier Part Number 2: 603-RC0603FR-07887KL
R14 = RC0603FR-07100KL: as R4 on sheet CH1-Input; Tolerance: 1%; PartNumber: RC0603FR-07100KL; Supplier 1: Digi-Key; Supplier 2: Mouser; Supplier Part Number 1: 311-100KHRCT-ND; Supplier Part Number 2: 603-RC0603FR-07100KL
R15 R16 = RC0603FR-071ML: as R5 on sheet CH1-Input; Tolerance: 1%; PartNumber: RC0603FR-071ML; Supplier 1: Digi-Key; Supplier 2: Mouser; Supplier Part Number 1: 311-887KHRCT-ND; Supplier Part Number 2: 603-RC0603FR-07887KL
U9 = ADA4051-2ARMZ: as U1 on sheet CH1-Input; Supplier 1: Digi-Key; Supplier 2: Mouser; Supplier Part Number 1: 505-ADA4051-2ARMZ-ND; Supplier Part Number 2: 584-ADA4051-2ARMZ
U10 = AD8253ARMZ: as U2 on sheet CH1-Input; PartNumber: AD8253ARMZ; Supplier 1: Digi-Key; Supplier 2: Mouser; Supplier Part Number 1: 505-AD8253ARMZ-R7DKR-ND; Supplier Part Number 2: 584-AD8253ARMZ-R7
U11 = AD8638ARJZ: as U3 on sheet CH1-Input; Supplier 1: Digi-Key; Supplier 2: Mouser; Supplier Part Number 1: 505-AD8638ARJZ-REEL7DKR-ND; Supplier Part Number 2: 584-AD8638ARJZ-R7
U12 = ADS1259BIPW: as U4 on sheet CH1-Input; Supplier 1: Digi-Key; Supplier 2: Mouser; Supplier Part Number 1: 296-27183-5-ND; Supplier Part Number 2: 595-ADS1259BIPW

## Sheet CH2-Isolation.SchDoc: CH2 ISOLATION
size A4; Author: MOG; CompanyName: GIE GROUP; DrawnBy: MOG; Organization: Gie SA; Address1: Galicia 52; Address2: Mar del Plata; Address3: Buenos Aires; Address4: Argentina; DocumentNumber: 5; Revision: 0.0; SheetNumber: 6; SheetTotal: 14; Project: CP DATALOGGER; PageSetup: Record=PageOptions|CenterHorizontal=True|CenterVertical=True|PrintScale=0.94|XCorrection=1.00|YCorrection=1.00|PrintKind=0|BorderSize=5000000|LeftOffset=0|BottomOffset=0|Orientation=2|PaperLength=1000|PaperWidth=1000|Scale=100|PaperSource=7|PrintQuality=720|MediaType=1|DitherType=10|PaperKind=A4|PrintScaleMode=1
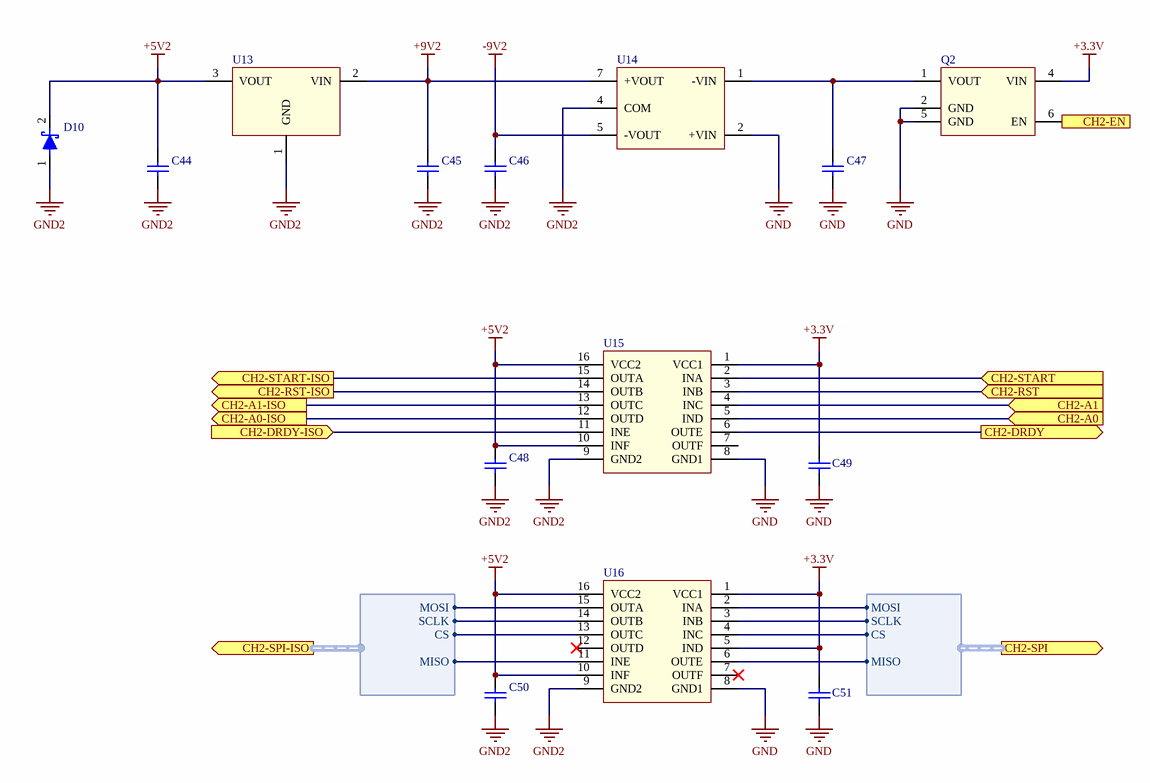
[diagram p4: CH2-Isolation.SchDoc]

### Parts
C44  C0603C105M3RAC7867  [CAP-0603]  (value not drawn)
C45  C0603C105M3RAC7867  [CAP-0603]  (value not drawn)
C46  C0603C105M3RAC7867  [CAP-0603]  (value not drawn)
C47  C0603C105M3RAC7867  [CAP-0603]  (value not drawn)
C48  C0603C105M3RAC7867  [CAP-0603]  (value not drawn)
C49  C0603C105M3RAC7867  [CAP-0603]  (value not drawn)
C50  C0603C105M3RAC7867  [CAP-0603]  (value not drawn)
C51  C0603C105M3RAC7867  [CAP-0603]  (value not drawn)
D10  (no value)  [SOD323 - DIODE UNIDIR]
Q2  (no value)  [TSSOP6]
U13  (no value)  [SOT23-5]
U14  R1D-3.309/P  [RECOM-R1D]  (value not drawn)
U15  (no value)  [SSOP16]
U16  (no value)  [SSOP16]

### Ports
CH2-A0 (in), CH2-A0-ISO (out), CH2-A1 (in), CH2-A1-ISO (out), CH2-DRDY (out), CH2-DRDY-ISO (in), CH2-EN (in), CH2-RST (in), CH2-RST-ISO (out), CH2-SPI (out, harness CH2-SPI), CH2-SPI-ISO (out, harness CH2-SPI-ISO), CH2-START (in), CH2-START-ISO (out)

### Harnesses
CH2-SPI-ISO: MOSI, MISO, SCLK, CS
CH2-SPI: MOSI, MISO, SCLK, CS

### Nets
+3.3V: C49.2 C51.2 Q2.4(VIN) U15.1(VCC1) U16.1(VCC1) U16.5(IND)
+5V2: C44.2 C48.2 C50.2 D10.2(K) U13.3(VOUT) U15.10(INF) U15.16(VCC2) U16.10(INF) U16.16(VCC2)
+9V2: C45.2 U13.2(VIN) U14.7(+VOUT)
-9V2: C46.2 U14.5(-VOUT)
GND: C47.1 C49.1 C51.1 Q2.2(GND) Q2.5(GND) U14.2(+VIN) U15.8(GND1) U16.8(GND1)
GND2: C44.1 C45.1 C46.1 C48.1 C50.1 D10.1(A) U13.1(GND) U14.4(COM) U15.9(GND2) U16.9(GND2)
CH2-A0: U15.5(IND) ; port CH2-A0
CH2-A1: U15.4(INC) ; port CH2-A1
CH2-DRDY: U15.6(OUTE) ; port CH2-DRDY
CH2-EN: Q2.6(EN) ; port CH2-EN
CH2-RST: U15.3(INB) ; port CH2-RST
CH2-SPI.CS: U16.4(INC) ; port CH2-SPI.CS
CH2-SPI.MISO: U16.6(OUTE) ; port CH2-SPI.MISO
CH2-SPI.MOSI: U16.2(INA) ; port CH2-SPI.MOSI
CH2-SPI.SCLK: U16.3(INB) ; port CH2-SPI.SCLK
CH2-START: U15.2(INA) ; port CH2-START
NetC47_2: C47.2 Q2.1(VOUT) U14.1(-VIN)
NetR16_2: U16.11(INE) ; port CH2-SPI-ISO.MISO
NetU10_4: U15.12(OUTD) ; port CH2-A0-ISO
NetU10_5: U15.13(OUTC) ; port CH2-A1-ISO
NetU12_3: U15.14(OUTB) ; port CH2-RST-ISO
NetU12_4: U15.15(OUTA) ; port CH2-START-ISO
NetU12_6: U16.13(OUTC) ; port CH2-SPI-ISO.CS
NetU12_7: U16.14(OUTB) ; port CH2-SPI-ISO.SCLK
NetU12_8: U16.15(OUTA) ; port CH2-SPI-ISO.MOSI
NetU12_10: U15.11(INE) ; port CH2-DRDY-ISO

Not connected (* = marked no-connect by the designer): U15 7(OUTF); U16 7(OUTF)* 12(OUTD)*

### Notes on the sheet
- PROYECTO:
- Rev:
- NOMBRE:
- FECHA:
- REALIZO:
- REVISO:
- APROBO:
- PAG:
- HOJA:
- DE
- A4

### Library data of the parts
C44-C51 = C0603C105M3RAC7867: as C10 on sheet CH1-Input; PartNumber: C0603C105M3RAC7867; Supplier 1: Digi-Key; Supplier 2: Mouser; Supplier Part Number 1: 399-C0603C105M3RAC7867CT-ND; Supplier Part Number 2: 80-C0603C105M3R
D10 = MM3Z5V6T1G: as D4 on sheet CH1-Isolation
Q2 = MIC94092YC6-TR: Manufacturer: Microchip
U13 = NCP716BCSN500T1G: as U5 on sheet CH1-Isolation
U14 = R1D-3.309/P: as U6 on sheet CH1-Isolation; Supplier 1: Digi-Key; Supplier 2: Mouser; Supplier Part Number 1: R1D-3.309/P-ND; Supplier Part Number 2: 919-R1D-3.309P
U15 U16 = ISO7762FDBQ: as U7 on sheet CH1-Isolation; Supplier 1: Digi-Key; Supplier 2: Mouser; Supplier Part Number 1: 296-49452-6-ND; Supplier Part Number 2: 595-ISO7762FDBQR

## Sheet Modem.SchDoc: MODEM
size A4; Author: MOG; CompanyName: GIE GROUP; DrawnBy: MOG; Organization: Gie SA; Address1: Galicia 52; Address2: Mar del Plata; Address3: Buenos Aires; Address4: Argentina; DocumentNumber: 9; Revision: 0.0; SheetNumber: 4; SheetTotal: 14; Project: CP DATALOGGER; PageSetup: Record=PageOptions|CenterHorizontal=True|CenterVertical=True|PrintScale=0.94|XCorrection=1.00|YCorrection=1.00|PrintKind=0|BorderSize=5000000|LeftOffset=0|BottomOffset=0|Orientation=2|PaperLength=1000|PaperWidth=1000|Scale=100|PaperSource=7|PrintQuality=720|MediaType=1|DitherType=10|PaperKind=A4|PrintScaleMode=1
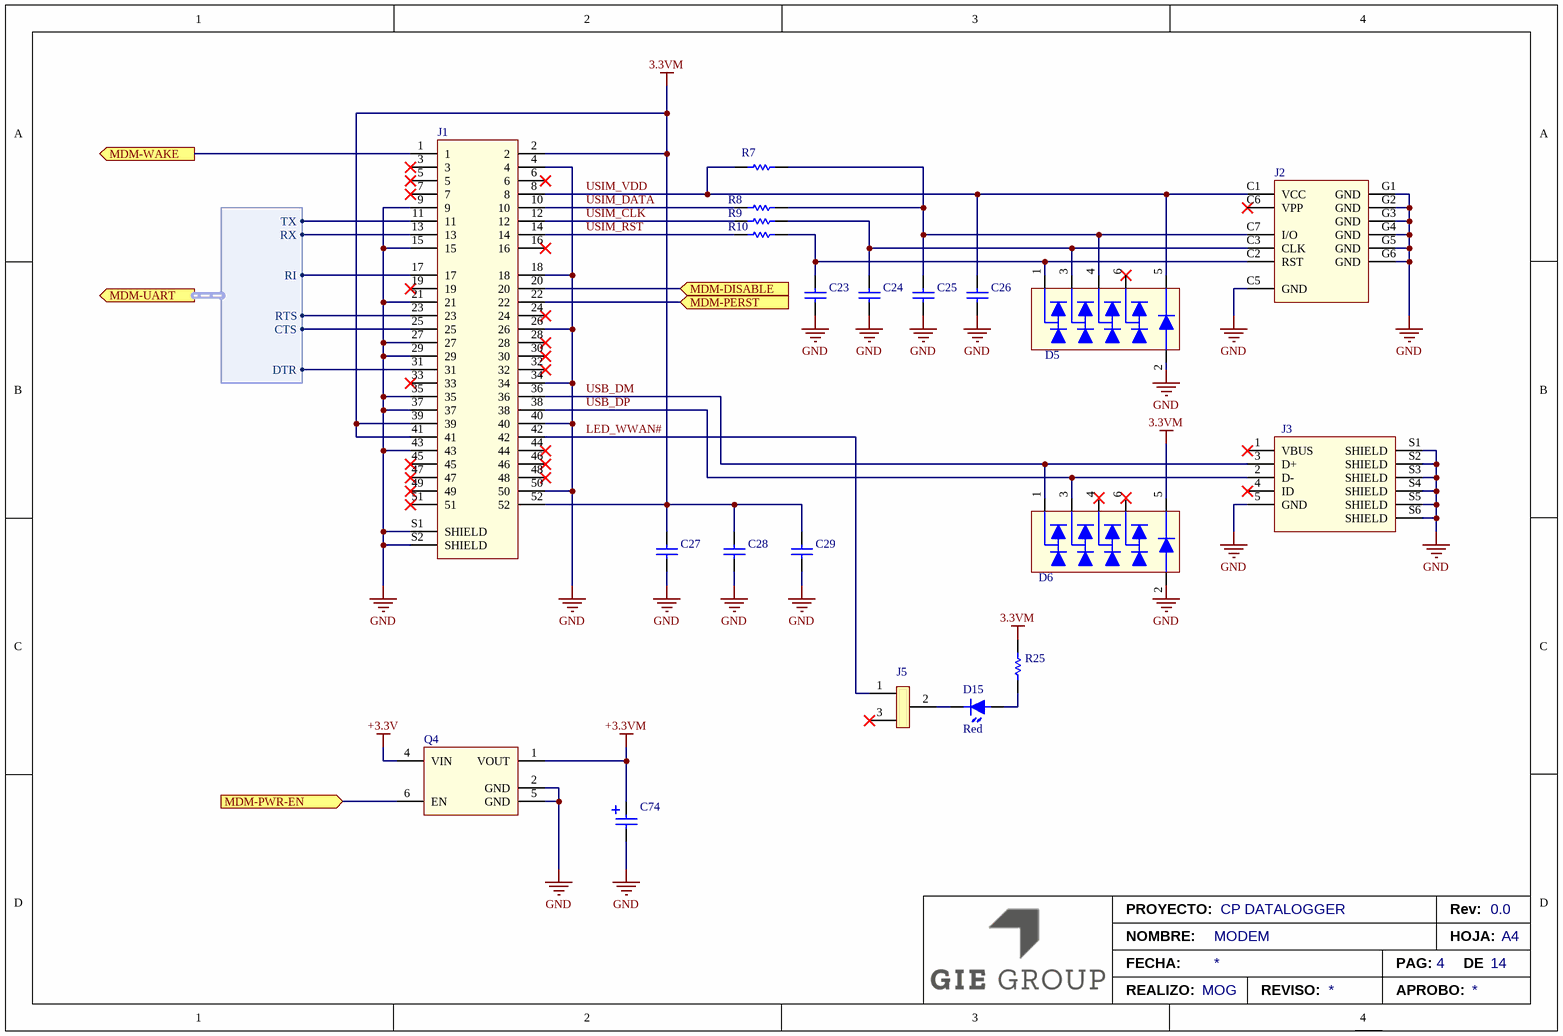
[diagram p5: Modem.SchDoc]

### Parts
C23  C0603C330F3GAC7867  [CAP-0603]  (value not drawn)
C24  C0603C330F3GAC7867  [CAP-0603]  (value not drawn)
C25  C0603C330F3GAC7867  [CAP-0603]  (value not drawn)
C26  C0603C330F3GAC7867  [CAP-0603]  (value not drawn)
C27  C0603C104K5RACAUTO  [CAP-0603]  (value not drawn)
C28  C0603C330F3GAC7867  [CAP-0603]  (value not drawn)
C29  C0603C100K3GAC7867  [CAP-0603]  (value not drawn)
C74  EEE-FK0J471P  [CAP_ALUM_SIZE_F]  (value not drawn)
D5  (no value)  [TSSOP6]
D6  (no value)  [TSSOP6]
D15  Color: Red  [0805 - LED]  (hidden comment: LTST-C170KRKT)
J1  0679100002  [MOLEX-679100002]  (value not drawn)
J2  (no value)  [MOLEX-786463001]
J3  473460001  [MOLEX-473460001]  (value not drawn)
J5  PRPC003SAAN-RC  [PIN3]  (value not drawn)
Q4  (no value)  [TSSOP6]
R7  RC0603FR-0715KL  [RES-0603]  (value not drawn)
R8  RC0603FR-0722RL  [RES-0603]  (value not drawn)
R9  RC0603FR-0722RL  [RES-0603]  (value not drawn)
R10  RC0603FR-0722RL  [RES-0603]  (value not drawn)
R25  RC0805FR-07100KL  [RES-0603]  (value not drawn)

### Ports
MDM-DISABLE (in), MDM-PERST (in), MDM-PWR-EN (in), MDM-UART (out, harness MDM-UART), MDM-WAKE (out)

### Harnesses
MDM-UART: RX, TX, RI, CTS, RTS, DTR

### Nets
3.3VM: C27.2 C28.2 C29.2 D6.5 J1.2 J1.39 J1.41 J1.52 R25.2
+3.3V: Q4.4(VIN)
+3.3VM: C74.1 Q4.1(VOUT)
GND: C23.1 C24.1 C25.1 C26.1 C27.1 C28.1 C29.1 C74.2 D5.2 D6.2 J1.4 J1.9 J1.15 J1.18 J1.21 J1.26 J1.27 J1.29 J1.34 J1.35 J1.37 J1.40 J1.43 J1.50 J1.S1(SHIELD) J1.S2(SHIELD) J2.C5(GND) J2.G1(GND) J2.G2(GND) J2.G3(GND) J2.G4(GND) J2.G5(GND) J2.G6(GND) J3.5(GND) J3.S1(SHIELD) J3.S2(SHIELD) J3.S3(SHIELD) J3.S4(SHIELD) J3.S5(SHIELD) J3.S6(SHIELD) Q4.2(GND) Q4.5(GND)
LED_WWAN#: J1.42 J5.1
MDM-DISABLE: J1.20 ; port MDM-DISABLE
MDM-PERST: J1.22 ; port MDM-PERST
MDM-PWR-EN: Q4.6(EN) ; port MDM-PWR-EN
MDM-UART.CTS: J1.25 ; port MDM-UART.CTS
MDM-UART.DTR: J1.31 ; port MDM-UART.DTR
MDM-UART.RI: J1.17 ; port MDM-UART.RI
MDM-UART.RTS: J1.23 ; port MDM-UART.RTS
MDM-UART.RX: J1.13 ; port MDM-UART.RX
MDM-UART.TX: J1.11 ; port MDM-UART.TX
MDM-WAKE: J1.1 ; port MDM-WAKE
USB_DM: D6.1 J1.36 J3.3(D+)
USB_DP: D6.3 J1.38 J3.2(D-)
USIM_CLK: J1.12 R9.1
USIM_DATA: J1.10 R8.1
USIM_RST: J1.14 R10.1
USIM_VDD: C26.2 D5.5 J1.8 J2.C1(VCC) R7.1
NetC23_2: C23.2 D5.1 J2.C2(RST) R10.2
NetC24_2: C24.2 D5.3 J2.C3(CLK) R9.2
NetC25_2: C25.2 D5.4 J2.C7(I/O) R7.2 R8.2
NetD15_1: D15.1(A) R25.1
NetD15_2: D15.2(K) J5.2

Not connected (* = marked no-connect by the designer): D5 6*; D6 4* 6*; J1 3* 5* 6* 7* 16* 19* 24* 28* 30* 32* 33* 44* 45* 46* 47* 48* 49* 51*; J2 C6(VPP)*; J3 1(VBUS)* 4(ID)*; J5 3*

### Notes on the sheet
- PROYECTO:
- Rev:
- NOMBRE:
- FECHA:
- REALIZO:
- REVISO:
- APROBO:
- PAG:
- HOJA:
- DE
- A4

### Library data of the parts
C23-C26 C28 = C0603C330F3GAC7867: CAP CER 33 pF 25V C0G 0603; Manufacturer: Kemet; Tolerance: 1%; PartNumber: C0603C330F3GAC7867; Voltage: 25V
C27 = C0603C104K5RACAUTO: as C1 on sheet CH1-Input; PartNumber: C0603C104K5RACAUTO; Supplier 1: Digi-Key; Supplier 2: Mouser; Supplier Part Number 1: 399-6856-1-ND; Supplier Part Number 2: 80-C0603C104K5RAUTO
C29 = C0603C100K3GAC7867: CAP CER 10 pF 25V C0G 0603; Manufacturer: Kemet; Tolerance: 10%; PartNumber: C0603C100K3GAC7867; Voltage: 25V
C74 = EEE-FK0J471P: CAP ALUM 470UF 20% 6.3V SMD; Manufacturer: Panasonic; Part}Number: EEE-FK0J471P
D5 D6 = CM1213A-04SO: TVS DIODE 3.3VWM 10VC 4CH SC74; Manufacturer: OnSemiconductor
D15 = LTST-C170KRKT: LED RED CLEAR 0805 SMD; Manufacturer: Lite-On Inc; Supplier 1: Digi-Key; Supplier Part Number 1: 160-1415-6-ND; Supplier 2: Mouser; Supplier Part Number 2: 859-LTST-C170KRKT; PartNumber: LTST-C170KRKT
J1 = Molex 0679100002: Connector Mini PCI Express 52POS - Quectel modem; Manufacturer: Molex; PartNumber: 0679100002; Supplier 1: Digi-Key; Supplier Part Number 1: WM3470CT-ND; Supplier 2: Mouser; Supplier Part Number 2: 538-67910-0002
J2 = 786463001: 6 Position Card Connector Micro SIM Surface Mount, Right Angle Gold; Supplier 1: Digi-Key; Supplier 2: Mouser; Supplier Part Number 1: WM9364CT-ND; Supplier Part Number 2: 538-78646-3001
J3 = 473460001: USB Connectors MICRO USB B RECPT BTTM MOUNT ASSY; Manufacturer: Molex; PartNumber: 473460001
J5 = PRPC003SAAN-RC: CONN HEADER .100" SNGL STR 3POS; Manufacturer: Sullins Connector Solutions; PartNumber: PRPC003SAAN-RC; Supplier 1: Digi-Key; Supplier Part Number 1: S1011EC-03-ND
Q4 = MIC94092YC6-TR: Manufacturer: Microchip
R7 = RC0603FR-0715KL: RES SMD 15.0K OHM 1% 1/10W 0603; Manufacturer: Yageo; Power: 0.1W; Tolerance: 1%; PartNumber: RC0603FR-0715KL
R8-R10 = RC0603FR-0722RL: RES SMD 22 OHM 1% 1/10W 0603; Manufacturer: Yageo; Power: 0.1W; Tolerance: 1%; PartNumber: RC0603FR-0722RL
R25 = RC0805FR-07105RL: RES SMD 105 OHM 1% 1/8W 0805; Manufacturer: Yageo; Power: 0.125W; Tolerance: 1%; PartNumber: RC0805FR-07100KL; Supplier 1: Digi-Key; Supplier Part Number 1: 311-100KCRCT-ND; Supplier 2: Mouser; Supplier Part Number 2: 603-RC0805FR-07100KL

## Sheet CH3-Input.SchDoc: CH3 INPUT
size A4; Author: MOG; CompanyName: GIE GROUP; DrawnBy: MOG; Organization: Gie SA; Address1: Galicia 52; Address2: Mar del Plata; Address3: Buenos Aires; Address4: Argentina; DocumentNumber: 6; Revision: 0.0; SheetNumber: 7; SheetTotal: 14; Project: CP DATALOGGER; PageSetup: Record=PageOptions|CenterHorizontal=True|CenterVertical=True|PrintScale=0.94|XCorrection=1.00|YCorrection=1.00|PrintKind=0|BorderSize=5000000|LeftOffset=0|BottomOffset=0|Orientation=2|PaperLength=1000|PaperWidth=1000|Scale=100|PaperSource=7|PrintQuality=720|MediaType=1|DitherType=10|PaperKind=A4|PrintScaleMode=1
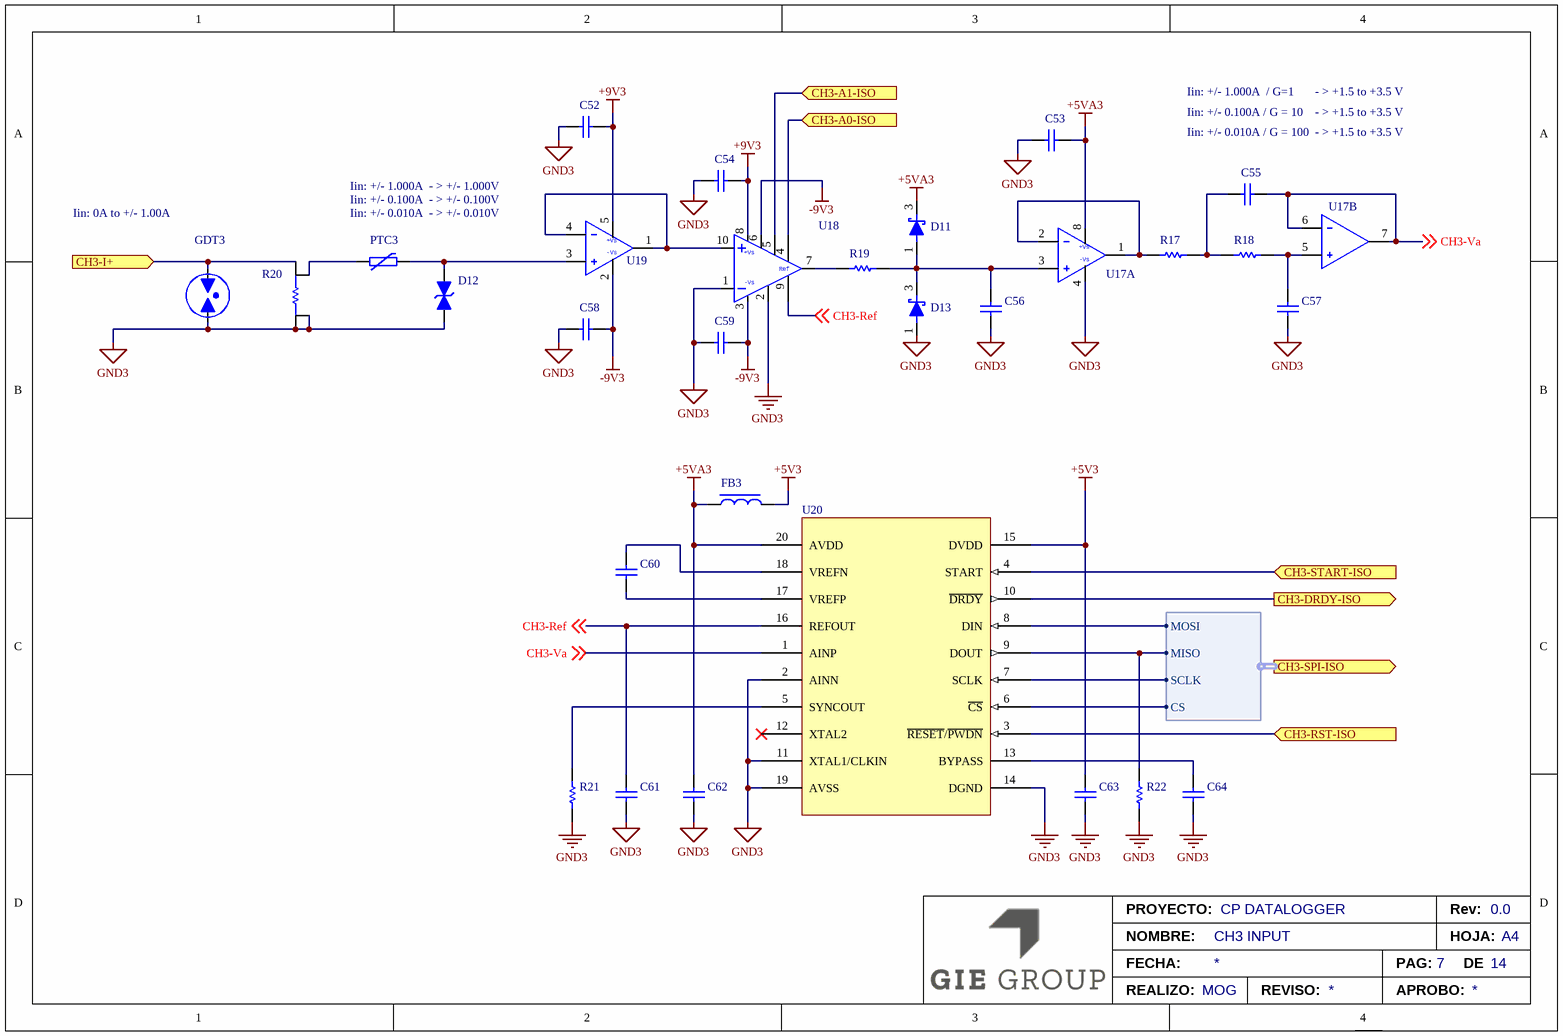
[diagram p6: CH3-Input.SchDoc]

### Parts
C52  C0603C104K5RACAUTO  [CAP-0603]  (value not drawn)
C53  C0603C104K5RACAUTO  [CAP-0603]  (value not drawn)
C54  C0603C104K5RACAUTO  [CAP-0603]  (value not drawn)
C55  C0603C162J5GAC7867  [CAP-0603]  (value not drawn)
C56  C0603C162J5GAC7867  [CAP-0603]  (value not drawn)
C57  C0603C161J1GAC7867  [CAP-0603]  (value not drawn)
C58  C0603C104K5RACAUTO  [CAP-0603]  (value not drawn)
C59  C0603C104K5RACAUTO  [CAP-0603]  (value not drawn)
C60  C0603C105M3RAC7867  [CAP-0603]  (value not drawn)
C61  C0603C105M3RAC7867  [CAP-0603]  (value not drawn)
C62  C0603C105M3RAC7867  [CAP-0603]  (value not drawn)
C63  C0603C105M3RAC7867  [CAP-0603]  (value not drawn)
C64  C0603C105M3RAC7867  [CAP-0603]  (value not drawn)
D11  NSVBAT54WT1G  [SOT-323-3]  (value not drawn)
D12  (no value)  [DIODE-0603]
D13  (no value)  [SOT-323-3]
FB3  Z0603C121GPWZT  [IND-0603]  (value not drawn)
GDT3  (no value)  [LITTLELFUSE-CG5XXXLTR]
PTC3  (no value)  [LITTLELFUSE-72R020X]
R17  RC0603FR-07113KL  [RES-0603]  (value not drawn)
R18  RC0603FR-07887KL  [RES-0603]  (value not drawn)
R19  RC0603FR-07100KL  [RES-0603]  (value not drawn)
R20  Y16061R00000B9W  [RES-2512 WIDE]  (value not drawn)
R21  RC0603FR-071ML  [RES-0603]  (value not drawn)
R22  RC0603FR-071ML  [RES-0603]  (value not drawn)
U17  (no value)  [MSOP8]  (parts A,B of 2)
U18  AD8253ARMZ  [MSOP10]  (value not drawn)
U19  (no value)  [SOT23-5]
U20  (no value)  [TSSOP20]

### Ports
CH3-A0-ISO (in), CH3-A1-ISO (in), CH3-DRDY-ISO (out), CH3-I+ (in), CH3-RST-ISO (in), CH3-SPI-ISO (out, harness CH3-SPI-ISO), CH3-START-ISO (in)

### Harnesses
CH3-SPI-ISO: MOSI, MISO, SCLK, CS

### Nets
+5V3: C63.2 FB3.2 U20.15(DVDD)
+5VA3: C53.2 C62.2 D11.3(K) FB3.1 U17.8(+VS) U20.20(AVDD)
+9V3: C52.2 C54.2 U18.8(+Vs) U19.5(+VS)
-9V3: C58.2 C59.2 U18.3(-Vs) U18.6(WR) U19.2(-Vs)
GND3: C52.1 C53.1 C54.1 C56.1 C57.1 C58.1 C59.1 C61.1 C62.1 C63.1 C64.1 D12.2(K) D13.1(A) GDT3.2(K) R20.E2 R20.I2 R21.1 R22.1 U17.4(-Vs) U18.1(-_IN) U18.2(DGND) U20.2(AINN) U20.11(XTAL1/CLKIN) U20.14(DGND) U20.19(AVSS)
CH3-Ref: C61.2 U18.9(REF) U20.16(REFOUT) ; off-sheet CH3-Ref
CH3-Va: C55.1 U17.6(-INB) U17.7(OUTB) U20.1(AINP) ; off-sheet CH3-Va
NetC55_2: C55.2 R17.2 R18.1
NetC56_2: C56.2 D11.1(A) D13.3(K) R19.2 U17.3(+INA)
NetC57_2: C57.2 R18.2 U17.5(+INB)
NetC60_1: C60.1 U20.17(VREFP)
NetC60_2: C60.2 U20.18(VREFN)
NetC64_2: C64.2 U20.13(BYPASS)
NetD12_1: D12.1(A) PTC3.2 U19.3(+IN)
NetGDT3_1: GDT3.1(A) R20.I1 ; port CH3-I+
NetPTC3_1: PTC3.1 R20.E1
NetR17_1: R17.1 U17.1(OUTA) U17.2(-INA)
NetR19_1: R19.1 U18.7(OUT)
NetR21_2: R21.2 U20.5(SYNCOUT)
NetR22_2: R22.2 U20.9(DOUT) ; port CH3-SPI-ISO.MISO
NetU18_4: U18.4(A0) ; port CH3-A0-ISO
NetU18_5: U18.5(A1) ; port CH3-A1-ISO
NetU18_10: U18.10(+_IN) U19.1(OUT) U19.4(-IN)
NetU20_3: U20.3(~{RESET}/~{PWDN}) ; port CH3-RST-ISO
NetU20_4: U20.4(START) ; port CH3-START-ISO
NetU20_6: U20.6(~{CS}) ; port CH3-SPI-ISO.CS
NetU20_7: U20.7(SCLK) ; port CH3-SPI-ISO.SCLK
NetU20_8: U20.8(DIN) ; port CH3-SPI-ISO.MOSI
NetU20_10: U20.10(~{DRDY}) ; port CH3-DRDY-ISO

Not connected (* = marked no-connect by the designer): U20 12(XTAL2)*

### Notes on the sheet
- Iin: +/- 1.000A  / G=1       - > +1.5 to +3.5 V
- Iin: +/- 0.100A / G = 10    - > +1.5 to +3.5 V
- Iin: +/- 0.010A / G = 100  - > +1.5 to +3.5 V
- Iin: 0A to +/- 1.00A
- Iin: +/- 1.000A  - > +/- 1.000V
- Iin: +/- 0.100A  - > +/- 0.100V
- Iin: +/- 0.010A  - > +/- 0.010V
- PROYECTO:
- Rev:
- NOMBRE:
- FECHA:
- REALIZO:
- REVISO:
- APROBO:
- PAG:
- HOJA:
- DE
- A4
- (in symbol AD8253ARMZ) Ref
- (in symbol AD8638ARJZ) +Vs
- (in symbol ADA4051-2ARMZ, part A) +Vs

### Library data of the parts
C52-C54 C58 C59 = C0603C104K5RACAUTO: as C1 on sheet CH1-Input; PartNumber: C0603C104K5RACAUTO; Supplier 1: Digi-Key; Supplier 2: Mouser; Supplier Part Number 1: 399-6856-1-ND; Supplier Part Number 2: 80-C0603C104K5RAUTO
C55 C56 = C0603C162J5GAC7867: as C4 on sheet CH1-Input; PartNumber: C0603C162J5GAC7867; Supplier 1: Digi-Key; Supplier 2: Mouser; Supplier Part Number 1: 399-15368-1-ND; Supplier Part Number 2: 80-C0603C162J5G
C57 = C0603C161J1GAC7867: as C7 on sheet CH1-Input; PartNumber: C0603C161J1GAC7867; Voltage: 100V; Supplier 1: Digi-Key; Supplier Part Number 1: 399-15367-1-ND
C60-C64 = C0603C105M3RAC7867: as C10 on sheet CH1-Input; PartNumber: C0603C105M3RAC7867; Supplier 1: Digi-Key; Supplier 2: Mouser; Supplier Part Number 1: 399-C0603C105M3RAC7867CT-ND; Supplier Part Number 2: 80-C0603C105M3R
D11 D13 = NSVBAT54WT1G: as D1 on sheet CH1-Input; VR(rms): 30V; Supplier 1: Digi-Key; Supplier 2: Mouser; Supplier Part Number 1: NSVBAT54WT1GOSDKR-ND; Supplier Part Number 2: 863-NSVBAT54WT1G
  D11: PartNumber: NSVBAT54WT1G
D12 = D3V3L1B2LP3-7: TVS Diode 1.5kW 130V 5% Bi-Directional; Manufacturer: Diodes Inc
FB3 = Z0603C121GPWZT: as FB1 on sheet CH1-Input; PartNumber: Z0603C121GPWZT; Supplier 1: Digi-Key; Supplier 2: Mouser; Supplier Part Number 1: 399-Z0603C121GPWZTCT-ND; Supplier Part Number 2: 80-Z0603C121GPWZT
GDT3 = CG5145LTR: as GDT1 on sheet CH1-Input; Supplier 1: Digi-Key; Supplier 2: Mouser; Supplier Part Number 1: CG5145LTR-ND; Supplier Part Number 2: 576-CG5145LTR
PTC3 = 72R020XPR: as PTC1 on sheet CH1-Input; Ihold: 0.2A; Supplier 1: Digi-Key; Supplier 2: Mouser; Supplier Part Number 1: 72R020XPRCT-ND; Supplier Part Number 2: 576-72R020XPR
R17 = RC0603FR-07113KL: as R2 on sheet CH1-Input; Tolerance: 1%; PartNumber: RC0603FR-07113KL; Supplier 1: Digi-Key; Supplier 2: Mouser; Supplier Part Number 2: 603-RC0603FR-07113KL; Supplier Part Number 1: 311-113KHRCT-ND
R18 = RC0603FR-07887KL: as R3 on sheet CH1-Input; Tolerance: 1%; PartNumber: RC0603FR-07887KL; Supplier 1: Digi-Key; Supplier 2: Mouser; Supplier Part Number 1: 311-887KHRCT-ND; Supplier Part Number 2: 603-RC0603FR-07887KL
R19 = RC0603FR-07100KL: as R4 on sheet CH1-Input; Tolerance: 1%; PartNumber: RC0603FR-07100KL; Supplier 1: Digi-Key; Supplier 2: Mouser; Supplier Part Number 1: 311-100KHRCT-ND; Supplier Part Number 2: 603-RC0603FR-07100KL
R20 = Y16061R00000B9W: RES SMD 1 OHM 1W 2516 WIDE; Manufacturer: Vishay; PartNumber: Y16061R00000B9W
R21 R22 = RC0603FR-071ML: as R5 on sheet CH1-Input; Tolerance: 1%; PartNumber: RC0603FR-071ML; Supplier 1: Digi-Key; Supplier 2: Mouser; Supplier Part Number 1: 311-887KHRCT-ND; Supplier Part Number 2: 603-RC0603FR-07887KL
U17 = ADA4051-2ARMZ: as U1 on sheet CH1-Input; Supplier 1: Digi-Key; Supplier 2: Mouser; Supplier Part Number 1: 505-ADA4051-2ARMZ-ND; Supplier Part Number 2: 584-ADA4051-2ARMZ
U18 = AD8253ARMZ: as U2 on sheet CH1-Input; PartNumber: AD8253ARMZ; Supplier 1: Digi-Key; Supplier 2: Mouser; Supplier Part Number 1: 505-AD8253ARMZ-R7DKR-ND; Supplier Part Number 2: 584-AD8253ARMZ-R7
U19 = AD8638ARJZ: as U3 on sheet CH1-Input; Supplier 1: Digi-Key; Supplier 2: Mouser; Supplier Part Number 1: 505-AD8638ARJZ-REEL7DKR-ND; Supplier Part Number 2: 584-AD8638ARJZ-R7
U20 = ADS1259BIPW: as U4 on sheet CH1-Input; Supplier 1: Digi-Key; Supplier 2: Mouser; Supplier Part Number 1: 296-27183-5-ND; Supplier Part Number 2: 595-ADS1259BIPW

## Sheet CH3-Isolation.SchDoc: CH3 ISOLATION
size A4; Author: MOG; CompanyName: GIE GROUP; DrawnBy: MOG; Organization: Gie SA; Address1: Galicia 52; Address2: Mar del Plata; Address3: Buenos Aires; Address4: Argentina; DocumentNumber: 7; Revision: 0.0; SheetNumber: 8; SheetTotal: 14; Project: CP DATALOGGER; PageSetup: Record=PageOptions|CenterHorizontal=True|CenterVertical=True|PrintScale=0.94|XCorrection=1.00|YCorrection=1.00|PrintKind=0|BorderSize=5000000|LeftOffset=0|BottomOffset=0|Orientation=2|PaperLength=1000|PaperWidth=1000|Scale=100|PaperSource=7|PrintQuality=720|MediaType=1|DitherType=10|PaperKind=A4|PrintScaleMode=1
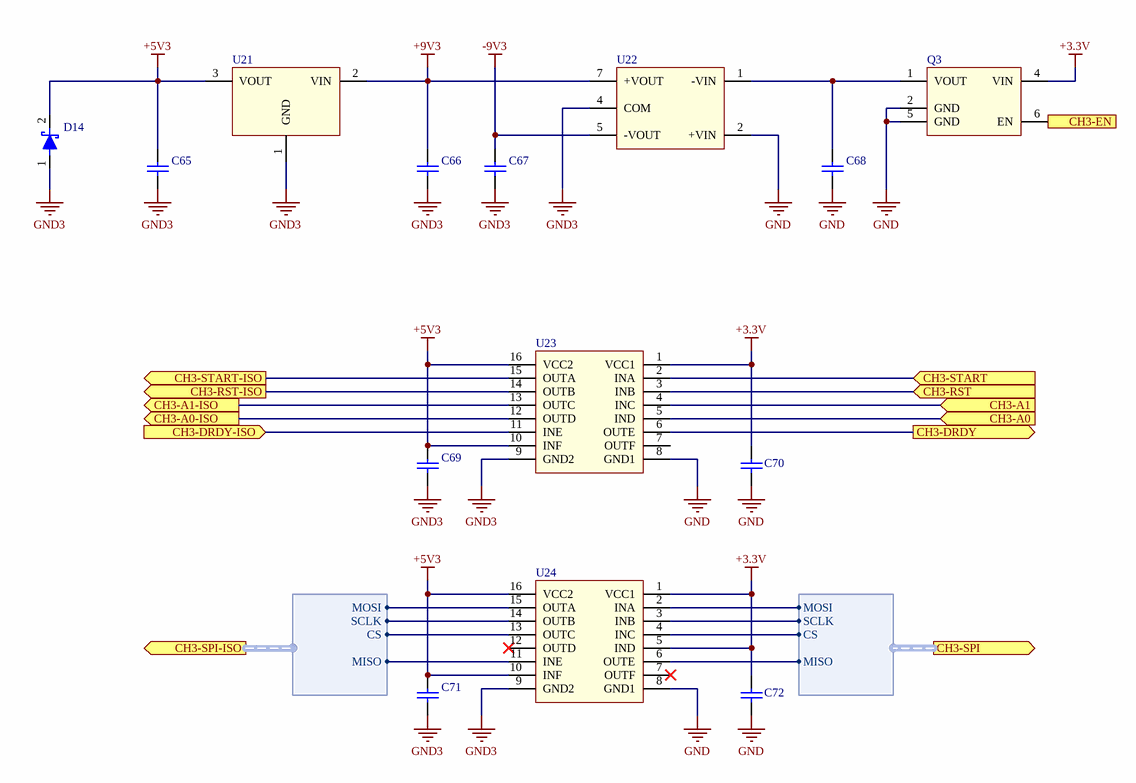
[diagram p7: CH3-Isolation.SchDoc]

### Parts
C65  C0603C105M3RAC7867  [CAP-0603]  (value not drawn)
C66  C0603C105M3RAC7867  [CAP-0603]  (value not drawn)
C67  C0603C105M3RAC7867  [CAP-0603]  (value not drawn)
C68  C0603C105M3RAC7867  [CAP-0603]  (value not drawn)
C69  C0603C105M3RAC7867  [CAP-0603]  (value not drawn)
C70  C0603C105M3RAC7867  [CAP-0603]  (value not drawn)
C71  C0603C105M3RAC7867  [CAP-0603]  (value not drawn)
C72  C0603C105M3RAC7867  [CAP-0603]  (value not drawn)
D14  (no value)  [SOD323 - DIODE UNIDIR]
Q3  (no value)  [TSSOP6]
U21  (no value)  [SOT23-5]
U22  R1D-3.309/P  [RECOM-R1D]  (value not drawn)
U23  (no value)  [SSOP16]
U24  (no value)  [SSOP16]

### Ports
CH3-A0 (in), CH3-A0-ISO (out), CH3-A1 (in), CH3-A1-ISO (out), CH3-DRDY (out), CH3-DRDY-ISO (in), CH3-EN (in), CH3-RST (in), CH3-RST-ISO (out), CH3-SPI (out, harness CH3-SPI), CH3-SPI-ISO (out, harness CH3-SPI-ISO), CH3-START (in), CH3-START-ISO (out)

### Harnesses
CH3-SPI-ISO: MOSI, MISO, SCLK, CS
CH3-SPI: MOSI, MISO, SCLK, CS

### Nets
+3.3V: C70.2 C72.2 Q3.4(VIN) U23.1(VCC1) U24.1(VCC1) U24.5(IND)
+5V3: C65.2 C69.2 C71.2 D14.2(K) U21.3(VOUT) U23.10(INF) U23.16(VCC2) U24.10(INF) U24.16(VCC2)
+9V3: C66.2 U21.2(VIN) U22.7(+VOUT)
-9V3: C67.2 U22.5(-VOUT)
GND: C68.1 C70.1 C72.1 Q3.2(GND) Q3.5(GND) U22.2(+VIN) U23.8(GND1) U24.8(GND1)
GND3: C65.1 C66.1 C67.1 C69.1 C71.1 D14.1(A) U21.1(GND) U22.4(COM) U23.9(GND2) U24.9(GND2)
CH3-A0: U23.5(IND) ; port CH3-A0
CH3-A1: U23.4(INC) ; port CH3-A1
CH3-DRDY: U23.6(OUTE) ; port CH3-DRDY
CH3-EN: Q3.6(EN) ; port CH3-EN
CH3-RST: U23.3(INB) ; port CH3-RST
CH3-SPI.CS: U24.4(INC) ; port CH3-SPI.CS
CH3-SPI.MISO: U24.6(OUTE) ; port CH3-SPI.MISO
CH3-SPI.MOSI: U24.2(INA) ; port CH3-SPI.MOSI
CH3-SPI.SCLK: U24.3(INB) ; port CH3-SPI.SCLK
CH3-START: U23.2(INA) ; port CH3-START
NetC68_2: C68.2 Q3.1(VOUT) U22.1(-VIN)
NetR22_2: U24.11(INE) ; port CH3-SPI-ISO.MISO
NetU18_4: U23.12(OUTD) ; port CH3-A0-ISO
NetU18_5: U23.13(OUTC) ; port CH3-A1-ISO
NetU20_3: U23.14(OUTB) ; port CH3-RST-ISO
NetU20_4: U23.15(OUTA) ; port CH3-START-ISO
NetU20_6: U24.13(OUTC) ; port CH3-SPI-ISO.CS
NetU20_7: U24.14(OUTB) ; port CH3-SPI-ISO.SCLK
NetU20_8: U24.15(OUTA) ; port CH3-SPI-ISO.MOSI
NetU20_10: U23.11(INE) ; port CH3-DRDY-ISO

Not connected (* = marked no-connect by the designer): U23 7(OUTF); U24 7(OUTF)* 12(OUTD)*

### Notes on the sheet
- PROYECTO:
- Rev:
- NOMBRE:
- FECHA:
- REALIZO:
- REVISO:
- APROBO:
- PAG:
- HOJA:
- DE
- A4

### Library data of the parts
C65-C72 = C0603C105M3RAC7867: as C10 on sheet CH1-Input; PartNumber: C0603C105M3RAC7867; Supplier 1: Digi-Key; Supplier 2: Mouser; Supplier Part Number 1: 399-C0603C105M3RAC7867CT-ND; Supplier Part Number 2: 80-C0603C105M3R
D14 = MM3Z5V6T1G: as D4 on sheet CH1-Isolation
Q3 = MIC94092YC6-TR: Manufacturer: Microchip
U21 = NCP716BCSN500T1G: as U5 on sheet CH1-Isolation
U22 = R1D-3.309/P: as U6 on sheet CH1-Isolation; Supplier 1: Digi-Key; Supplier 2: Mouser; Supplier Part Number 1: R1D-3.309/P-ND; Supplier Part Number 2: 919-R1D-3.309P
U23 U24 = ISO7762FDBQ: as U7 on sheet CH1-Isolation; Supplier 1: Digi-Key; Supplier 2: Mouser; Supplier Part Number 1: 296-49452-6-ND; Supplier Part Number 2: 595-ISO7762FDBQR